# EAGLE design Printrboard (EAGLE 6.6.0)
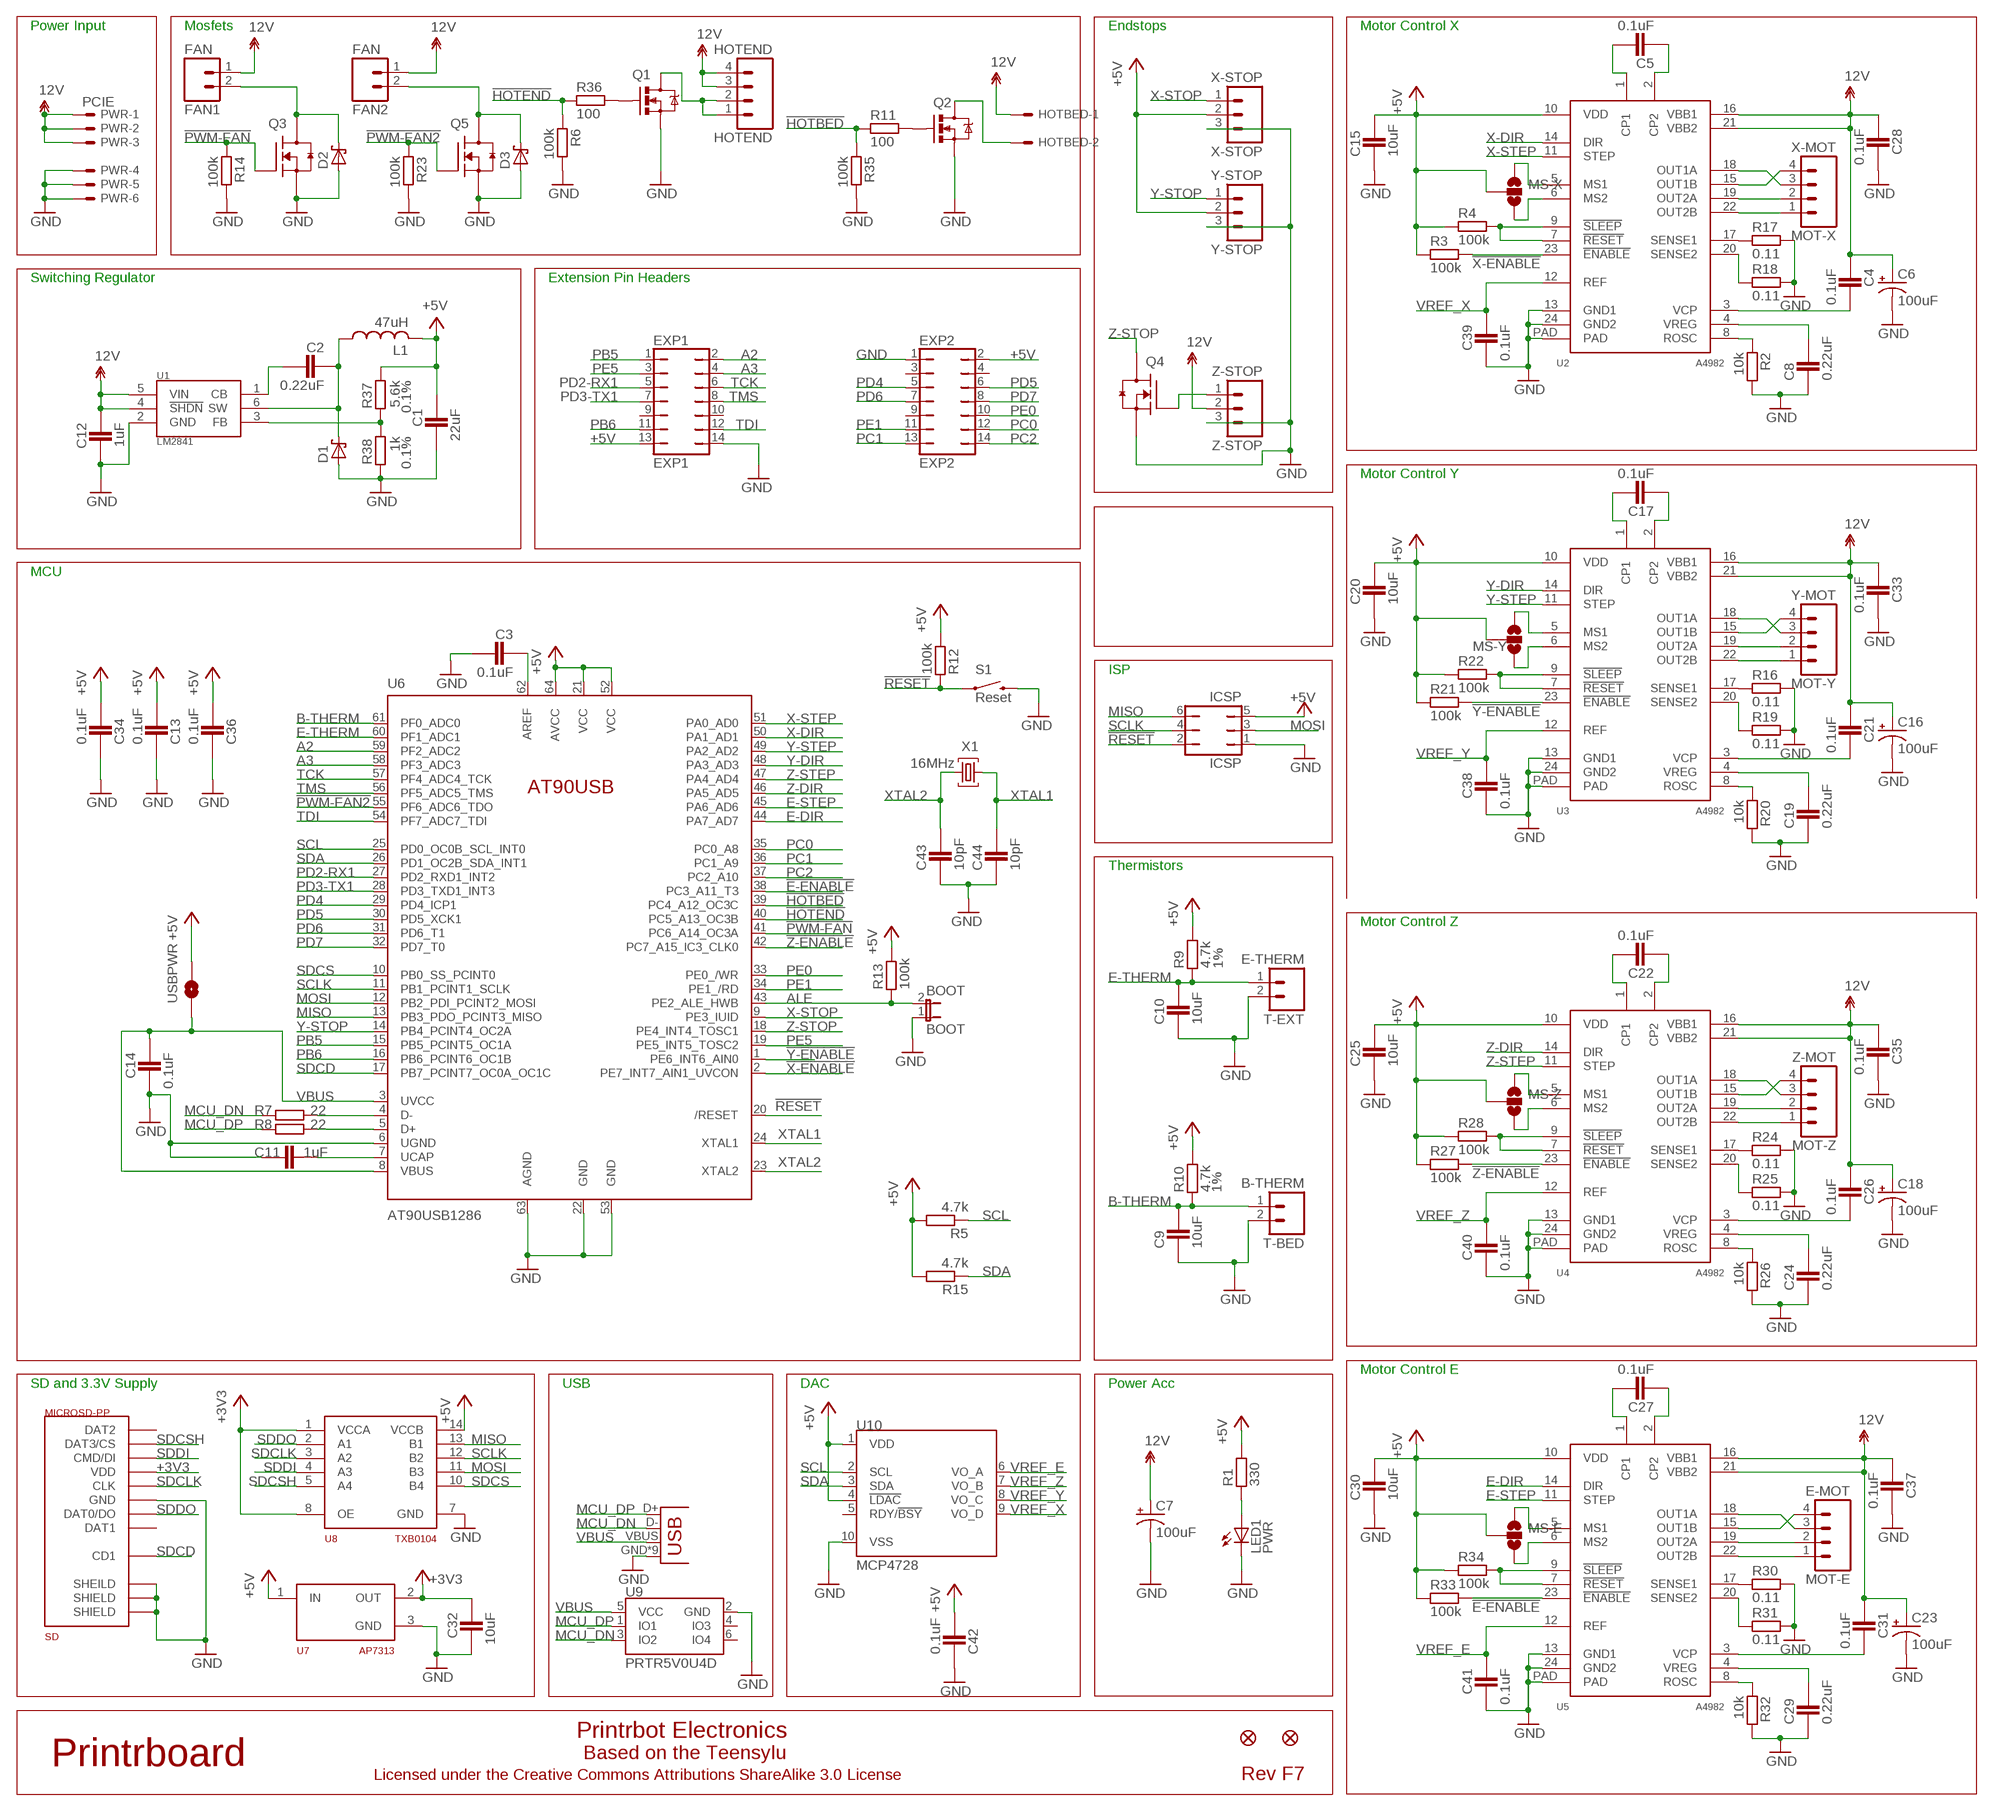
[diagram p0: schematic, sheet 1]

## Parts
BOOT  BOOT  JUMPER-2PTH  [1X02]
C1  22uF  CAPACITOR_0805  [CAPC2012X145AN]
C2  0.22uF  CAPACITOR_0805  [CAPC2012X145AN]
C3  0.1uF  CAPACITOR_0805  [CAPC2012X145AN]
C4  0.1uF  CAPACITOR_0805  [CAPC2012X145AN]
C5  0.1uF  CAPACITOR_0805  [CAPC2012X145AN]
C6  100uF  CPOL-USD  [PANASONIC_D]
C7  100uF  CPOL-USD  [PANASONIC_D]
C8  0.22uF  CAPACITOR_0805  [CAPC2012X145AN]
C9  10uF  CAPACITOR_0805  [CAPC2012X145AN]
C10  10uF  CAPACITOR_0805  [CAPC2012X145AN]
C11  1uF  CAPACITOR_0805  [CAPC2012X145AN]
C12  1uF  CAPACITOR_0805  [CAPC2012X145AN]
C13  0.1uF  CAPACITOR_0805  [CAPC2012X145AN]
C14  0.1uF  CAPACITOR_0805  [CAPC2012X145AN]
C15  10uF  CAPACITOR_0805  [CAPC2012X145AN]
C16  100uF  CPOL-USD  [PANASONIC_D]
C17  0.1uF  CAPACITOR_0805  [CAPC2012X145AN]
C18  100uF  CPOL-USD  [PANASONIC_D]
C19  0.22uF  CAPACITOR_0805  [CAPC2012X145AN]
C20  10uF  CAPACITOR_0805  [CAPC2012X145AN]
C21  0.1uF  CAPACITOR_0805  [CAPC2012X145AN]
C22  0.1uF  CAPACITOR_0805  [CAPC2012X145AN]
C23  100uF  CPOL-USD  [PANASONIC_D]
C24  0.22uF  CAPACITOR_0805  [CAPC2012X145AN]
C25  10uF  CAPACITOR_0805  [CAPC2012X145AN]
C26  0.1uF  CAPACITOR_0805  [CAPC2012X145AN]
C27  0.1uF  CAPACITOR_0805  [CAPC2012X145AN]
C28  0.1uF  CAPACITOR_0805  [CAPC2012X145AN]
C29  0.22uF  CAPACITOR_0805  [CAPC2012X145AN]
C30  10uF  CAPACITOR_0805  [CAPC2012X145AN]
C31  0.1uF  CAPACITOR_0805  [CAPC2012X145AN]
C32  10uF  CAPACITOR_0805  [CAPC2012X145AN]
C33  0.1uF  CAPACITOR_0805  [CAPC2012X145AN]
C34  0.1uF  CAPACITOR_0805  [CAPC2012X145AN]
C35  0.1uF  CAPACITOR_0805  [CAPC2012X145AN]
C36  0.1uF  CAPACITOR_0805  [CAPC2012X145AN]
C37  0.1uF  CAPACITOR_0805  [CAPC2012X145AN]
C38  0.1uF  CAPACITOR_0805  [CAPC2012X145AN]
C39  0.1uF  CAPACITOR_0805  [CAPC2012X145AN]
C40  0.1uF  CAPACITOR_0805  [CAPC2012X145AN]
C41  0.1uF  CAPACITOR_0805  [CAPC2012X145AN]
C42  0.1uF  CAPACITOR_0805  [CAPC2012X145AN]
C43  10pF  CAPACITOR_0805  [CAPC2012X145AN]
C44  10pF  CAPACITOR_0805  [CAPC2012X145AN]
D1  SCH-DIODESMA  [SMA]
D2  SCH-DIODESMA  [SMA]
D3  SCH-DIODESMA  [SMA]
E-MOT  MOT-E  M04POLAR  [MOLEX-1X4]
EXP1  EXP1  JP7Q  [JP7Q]
EXP2  EXP2  JP7Q  [JP7Q]
FAN1  FAN  M02PTH  [1X02]
FAN2  FAN  M02PTH  [1X02]
HOTBED  PHOENIX-2POS-5MM-SCREW  [PHOENIX-5MM-2POS]
HOTEND  HOTEND  M04POLAR  [MOLEX-1X4]
ICSP  ICSP  JP3Q  [JP3Q]
JP26  FIDUCIAL1X2.5  [FIDUCIAL-1X2.5]
JP33  FIDUCIAL1X2.5  [FIDUCIAL-1X2.5]
L1  47uH  L-US  [SDR1006]
LED1  PWR  LEDCHIP-LED0805  [CHIP-LED0805]
MS-E  SOLDERJUMPER_2WAYCONNECTED  [SJ_3_CONNECTED]
MS-X  SOLDERJUMPER_2WAYCONNECTED  [SJ_3_CONNECTED]
MS-Y  SOLDERJUMPER_2WAYCONNECTED  [SJ_3_CONNECTED]
MS-Z  SOLDERJUMPER_2WAYCONNECTED  [SJ_3_CONNECTED]
PWR  PCIE  5566-6  [5566-6]
Q1  RFP30N06LE  MOSFET-NCHANNELPTH2  [TO220V]
Q2  RFP30N06LE  MOSFET-NCHANNELPTH2  [TO220V]
Q3  RFP30N06LE  MOSFET-NCH_SOT-23  [SOT95P280X135-3N]
Q4  RFP30N06LE  MOSFET-NCH_SOT-23  [SOT95P280X135-3N]
Q5  RFP30N06LE  MOSFET-NCH_SOT-23  [SOT95P280X135-3N]
R1  330  RESISTOR_0805  [RESC2012X70N]
R2  10k  RESISTOR_0805  [RESC2012X70N]
R3  100k  RESISTOR_0805  [RESC2012X70N]
R4  100k  RESISTOR_0805  [RESC2012X70N]
R5  4.7k  RESISTOR_0805  [RESC2012X70N]
R6  100k  RESISTOR_0805  [RESC2012X70N]
R7  22  RESISTOR_0805  [RESC2012X70N]
R8  22  RESISTOR_0805  [RESC2012X70N]
R9  4.7k  RESISTOR_0805  [RESC2012X70N]
R10  4.7k  RESISTOR_0805  [RESC2012X70N]
R11  100  RESISTOR_0805  [RESC2012X70N]
R12  100k  RESISTOR_0805  [RESC2012X70N]
R13  100k  RESISTOR_0805  [RESC2012X70N]
R14  100k  RESISTOR_0805  [RESC2012X70N]
R15  4.7k  RESISTOR_0805  [RESC2012X70N]
R16  0.11  RESISTOR_0805  [RESC2012X70N]
R17  0.11  RESISTOR_0805  [RESC2012X70N]
R18  0.11  RESISTOR_0805  [RESC2012X70N]
R19  0.11  RESISTOR_0805  [RESC2012X70N]
R20  10k  RESISTOR_0805  [RESC2012X70N]
R21  100k  RESISTOR_0805  [RESC2012X70N]
R22  100k  RESISTOR_0805  [RESC2012X70N]
R23  100k  RESISTOR_0805  [RESC2012X70N]
R24  0.11  RESISTOR_0805  [RESC2012X70N]
R25  0.11  RESISTOR_0805  [RESC2012X70N]
R26  10k  RESISTOR_0805  [RESC2012X70N]
R27  100k  RESISTOR_0805  [RESC2012X70N]
R28  100k  RESISTOR_0805  [RESC2012X70N]
R30  0.11  RESISTOR_0805  [RESC2012X70N]
R31  0.11  RESISTOR_0805  [RESC2012X70N]
R32  10k  RESISTOR_0805  [RESC2012X70N]
R33  100k  RESISTOR_0805  [RESC2012X70N]
R34  100k  RESISTOR_0805  [RESC2012X70N]
R35  100k  RESISTOR_0805  [RESC2012X70N]
R36  100  RESISTOR_0805  [RESC2012X70N]
R37  5.6k  RESISTOR_0805  [RESC2012X70N]
R38  1k  RESISTOR_0805  [RESC2012X70N]
S1  Reset  SWITCH-MOMENTARY-2  [TACTILE_SWITCH_TALL]
SD  MICROSD-PP  [USD-101-00660-68-6]
T-BED  B-THERM  M02PTH  [1X02]
T-EXT  E-THERM  M02PTH  [1X02]
U1  LM2841  [TSOT6]
U2  A4982  [TSSOP-24]
U3  A4982  [TSSOP-24]
U4  A4982  [TSSOP-24]
U5  A4982  [TSSOP-24]
U6  AT90USB1286  AT90USB  [TQFP64-2]
U7  AP7313  [SOT23C]
U8  TXB0104  [TSSOP14]
U9  PRTR5V0U4D  [SOT23-6]
U10  MCP4728  [MSOP10]
USB-M  USB-MICRO-PTH  [USB-MICROB-PTH]
USBPWR  SOLDERJUMPERNO  [SJ_2S-NO]
X1  16MHz  XTAL  [NDK-XTAL]
X-MOT  MOT-X  M04POLAR  [MOLEX-1X4]
X-STOP  X-STOP  M03POLAR  [MOLEX-1X3]
Y-MOT  MOT-Y  M04POLAR  [MOLEX-1X4]
Y-STOP  Y-STOP  M03POLAR  [MOLEX-1X3]
Z-MOT  MOT-Z  M04POLAR  [MOLEX-1X4]
Z-STOP  Z-STOP  M03POLAR  [MOLEX-1X3]

## Nets
12V: C4.1 C6.+ C7.+ C12.1 C16.+ C18.+ C21.1 C23.+ C26.1 C28.1 C31.1 C33.1 C35.1 C37.1 FAN1.1 FAN2.1 HOTBED.P$1 HOTEND.3 HOTEND.4 PWR.1 PWR.2 PWR.3 U1.4(!SHDN) U1.5(VIN) U2.16(VBB1) U2.21(VBB2) U3.16(VBB1) U3.21(VBB2) U4.16(VBB1) U4.21(VBB2) U5.16(VBB1) U5.21(VBB2) Z-STOP.2
!E-ENABLE: R33.2 U5.23(!ENABLE) U6.38(PC3_A11_T3)
!HOTBED: R11.1 R35.1 U6.39(PC4_A12_OC3C)
!HOTEND: R6.1 R36.1 U6.40(PC5_A13_OC3B)
!PWM-FAN: Q3.1(G) R14.1 U6.41(PC6_A14_OC3A)
!PWM-FAN2: Q5.1(G) R23.1 U6.55(PF6_ADC6_TDO)
!RESET: ICSP.2 R12.1 S1.A2 U6.20(/RESET)
!X-ENABLE: R3.2 U2.23(!ENABLE) U6.2(PE7_INT7_AIN1_UVCON)
!Y-ENABLE: R21.2 U3.23(!ENABLE) U6.1(PE6_INT6_AIN0)
!Z-ENABLE: R27.2 U4.23(!ENABLE) U6.42(PC7_A15_IC3_CLK0)
+3V3 [power]: C32.1 SD.P$4(VDD) U7.2(OUT) U8.1(VCCA) U8.8(OE)
+5V [power]: C1.1 C13.2 C15.2 C20.2 C25.2 C30.2 C34.2 C36.2 C42.2 EXP1.13 EXP2.2 ICSP.5 L1.P$2 MS-E.2 MS-X.2 MS-Y.2 MS-Z.2 R1.2 R3.1 R4.1 R5.2 R9.2 R10.2 R12.2 R13.2 R15.2 R21.1 R22.1 R27.1 R28.1 R33.1 R34.1 R37.1 U2.10(VDD) U3.10(VDD) U4.10(VDD) U5.10(VDD) U6.21(VCC) U6.52(VCC) U6.64(AVCC) U7.1(IN) U8.14(VCCB) U10.1(VDD) U10.4(!LDAC) USBPWR.2 X-STOP.2 Y-STOP.2
A2: EXP1.2 U6.59(PF2_ADC2)
A3: EXP1.4 U6.58(PF3_ADC3)
ALE: BOOT.2 R13.1 U6.43(PE2_ALE_HWB)
AREF: C3.1 U6.62(AREF)
B-THERM: C9.2 R10.1 T-BED.1 U6.61(PF0_ADC0)
E-DIR: U5.14(DIR) U6.44(PA7_AD7)
E-STEP: U5.11(STEP) U6.45(PA6_AD6)
E-THERM: C10.2 R9.1 T-EXT.1 U6.60(PF1_ADC1)
GND [power]: BOOT.1 C1.2 C3.2 C6.- C7.- C8.1 C9.1 C10.1 C11.1 C12.2 C13.1 C14.2 C15.1 C16.- C18.- C19.1 C20.1 C23.- C24.1 C25.1 C28.2 C29.1 C30.1 C32.2 C33.2 C34.1 C35.2 C36.1 C37.2 C38.2 C39.2 C40.2 C41.2 C42.1 C43.1 C44.1 D1.A D2.A D3.A EXP1.14 EXP2.1 ICSP.1 LED1.C PWR.4 PWR.5 PWR.6 Q1.3(S) Q2.3(S) Q3.2(S) Q4.2(S) Q5.2(S) R2.2 R6.2 R14.2 R16.2 R17.2 R18.2 R19.2 R20.2 R23.2 R24.2 R25.2 R26.2 R30.2 R31.2 R32.2 R35.2 R38.2 S1.B2 SD.GND1(SHEILD) SD.GND2(SHIELD) SD.GND3(SHIELD) SD.P$6(GND) T-BED.2 T-EXT.2 U1.2(GND) U2.13(GND1) U2.24(GND2) U2.PAD U3.13(GND1) U3.24(GND2) U3.PAD U4.13(GND1) U4.24(GND2) U4.PAD U5.13(GND1) U5.24(GND2) U5.PAD U6.6(UGND) U6.22(GND) U6.53(GND) U6.63(AGND) U7.3(GND) U8.7(GND) U9.2(GND) U10.10(VSS) USB-M.GND USB-M.GND1(GND) USB-M.GND2(GND) USB-M.GND3(GND) USB-M.GND4(GND) USB-M.GND5(GND) USB-M.GND6(GND) USB-M.GND7(GND) USB-M.GND8(GND) X-STOP.3 Y-STOP.3 Z-STOP.3
HOTBED-GND [power]: HOTBED.P$2 Q2.2(D)
HOTEND-GND [power]: HOTEND.1 HOTEND.2 Q1.2(D)
MCU_DN: R7.1 U9.3(IO2) USB-M.D-
MCU_DP: R8.1 U9.1(IO1) USB-M.D+
MISO: ICSP.6 U6.13(PB3_PDO_PCINT3_MISO) U8.13(B1)
MOSI: ICSP.3 U6.12(PB2_PDI_PCINT2_MOSI) U8.11(B3)
N$1: LED1.A R1.1
N$2: D2.C FAN1.2 Q3.3(D)
N$3: R7.2 U6.4(D-)
N$4: R8.2 U6.5(D+)
N$6: Q4.1(G) Z-STOP.1
N$7: Q2.1(G) R11.2
N$8: D3.C FAN2.2 Q5.3(D)
N$9: C11.2 U6.7(UCAP)
N$10: U2.18(OUT1A) X-MOT.3
N$11: C5.2 U2.1(CP1)
N$12: C5.1 U2.2(CP2)
N$13: R2.1 U2.8(ROSC)
N$14: R17.1 U2.17(SENSE1)
N$15: R18.1 U2.20(SENSE2)
N$16: C4.2 U2.3(VCP)
N$17: U2.15(OUT1B) X-MOT.4
N$19: C8.2 U2.4(VREG)
N$20: U2.19(OUT2A) X-MOT.2
N$21: R4.2 U2.7(!RESET) U2.9(!SLEEP)
N$22: R37.2 R38.1 U1.3(FB)
N$23: U2.22(OUT2B) X-MOT.1
N$24: U3.19(OUT2A) Y-MOT.2
N$25: U3.22(OUT2B) Y-MOT.1
N$26: U3.15(OUT1B) Y-MOT.4
N$27: MS-X.1 U2.5(MS1)
N$28: MS-X.3 U2.6(MS2)
N$29: C17.2 U3.1(CP1)
N$30: C17.1 U3.2(CP2)
N$31: U3.18(OUT1A) Y-MOT.3
N$32: R19.1 U3.20(SENSE2)
N$34: R20.1 U3.8(ROSC)
N$35: C19.2 U3.4(VREG)
N$36: R22.2 U3.7(!RESET) U3.9(!SLEEP)
N$37: C21.2 U3.3(VCP)
N$38: R16.1 U3.17(SENSE1)
N$39: U4.15(OUT1B) Z-MOT.4
N$40: U4.18(OUT1A) Z-MOT.3
N$41: U4.19(OUT2A) Z-MOT.2
N$42: MS-Y.1 U3.5(MS1)
N$43: MS-Y.3 U3.6(MS2)
N$44: C22.2 U4.1(CP1)
N$45: C22.1 U4.2(CP2)
N$46: R24.1 U4.17(SENSE1)
N$47: R25.1 U4.20(SENSE2)
N$49: R26.1 U4.8(ROSC)
N$50: C24.2 U4.4(VREG)
N$51: R28.2 U4.7(!RESET) U4.9(!SLEEP)
N$52: C26.2 U4.3(VCP)
N$53: U4.22(OUT2B) Z-MOT.1
N$54: E-MOT.4 U5.15(OUT1B)
N$55: E-MOT.3 U5.18(OUT1A)
N$56: E-MOT.2 U5.19(OUT2A)
N$57: MS-Z.1 U4.5(MS1)
N$58: MS-Z.3 U4.6(MS2)
N$59: C27.2 U5.1(CP1)
N$60: C27.1 U5.2(CP2)
N$61: R30.1 U5.17(SENSE1)
N$62: R31.1 U5.20(SENSE2)
N$64: R32.1 U5.8(ROSC)
N$65: C29.2 U5.4(VREG)
N$66: R34.2 U5.7(!RESET) U5.9(!SLEEP)
N$67: C31.2 U5.3(VCP)
N$68: E-MOT.1 U5.22(OUT2B)
N$71: Q1.1(G) R36.2
N$72: MS-E.1 U5.5(MS1)
N$73: MS-E.3 U5.6(MS2)
N$75: C2.1 D1.C L1.P$1 U1.6(SW)
N$77: C2.2 U1.1(CB)
PB5: EXP1.1 U6.15(PB5_PCINT5_OC1A)
PB6: EXP1.11 U6.16(PB6_PCINT6_OC1B)
PC0: EXP2.12 U6.35(PC0_A8)
PC1: EXP2.13 U6.36(PC1_A9)
PC2: EXP2.14 U6.37(PC2_A10)
PD2-RX1: EXP1.5 U6.27(PD2_RXD1_INT2)
PD3-TX1: EXP1.7 U6.28(PD3_TXD1_INT3)
PD4: EXP2.5 U6.29(PD4_ICP1)
PD5: EXP2.6 U6.30(PD5_XCK1)
PD6: EXP2.7 U6.31(PD6_T1)
PD7: EXP2.8 U6.32(PD7_T0)
PE0: EXP2.10 U6.33(PE0_/WR)
PE1: EXP2.11 U6.34(PE1_/RD)
PE5: EXP1.3 U6.19(PE5_INT5_TOSC2)
SCL [power]: R5.1 U6.25(PD0_OC0B_SCL_INT0) U10.2(SCL)
SCLK: ICSP.4 U6.11(PB1_PCINT1_SCLK) U8.12(B2)
SDA [power]: R15.1 U6.26(PD1_OC2B_SDA_INT1) U10.3(SDA)
SDCD: SD.CD(CD1) U6.17(PB7_PCINT7_OC0A_OC1C)
SDCLK: SD.P$5(CLK) U8.3(A2)
SDCS: U6.10(PB0_SS_PCINT0) U8.10(B4)
SDCSH: SD.P$2(DAT3/CS) U8.5(A4)
SDDI: SD.P$3(CMD/DI) U8.4(A3)
SDDO: SD.P$7(DAT0/DO) U8.2(A1)
TCK: EXP1.6 U6.57(PF4_ADC4_TCK)
TDI: EXP1.12 U6.54(PF7_ADC7_TDI)
TMS: EXP1.8 U6.56(PF5_ADC5_TMS)
VBUS: C14.1 U6.3(UVCC) U6.8(VBUS) U9.5(VCC) USB-M.VBUS USBPWR.1
VREF_E: C41.1 U5.12(REF) U10.6(VO_A)
VREF_X: C39.1 U2.12(REF) U10.9(VO_D)
VREF_Y: C38.1 U3.12(REF) U10.8(VO_C)
VREF_Z: C40.1 U4.12(REF) U10.7(VO_B)
X-DIR: U2.14(DIR) U6.50(PA1_AD1)
X-STEP: U2.11(STEP) U6.51(PA0_AD0)
X-STOP: U6.9(PE3_IUID) X-STOP.1
XTAL1: C44.2 U6.24(XTAL1) X1.P$1
XTAL2: C43.2 U6.23(XTAL2) X1.P$2
Y-DIR: U3.14(DIR) U6.48(PA3_AD3)
Y-STEP: U3.11(STEP) U6.49(PA2_AD2)
Y-STOP: U6.14(PB4_PCINT4_OC2A) Y-STOP.1
Z-DIR: U4.14(DIR) U6.46(PA5_AD5)
Z-STEP: U4.11(STEP) U6.47(PA4_AD4)
Z-STOP: Q4.3(D) U6.18(PE4_INT4_TOSC1)
Unconnected: EXP1.9 EXP1.10 EXP2.3 EXP2.4 EXP2.9 SD.P$1(DAT2) SD.P$8(DAT1) U9.4(IO3) U9.6(IO4) U10.5(RDY/!BSY)

## Notes on the sheet
- Power Input | Mosfets | Endstops | Motor Control X
- Switching Regulator | Extension Pin Headers
- Motor Control Y
- MCU
- ISP
- Thermistors
- Motor Control Z
- Motor Control E
- SD and 3.3V Supply | USB | DAC | Power Acc
- Printrbot Electronics
- Based on the Teensylu
- Printrboard
- Licensed under the Creative Commons Attributions ShareAlike 3.0 License | Rev F7

## Library data of the parts
BOOT = SparkFun:JUMPER-2: Jumper Basic 0.1" spaced jumper. Use with breakaway headers.
C1-C5 C8-C15 C17 C19-C22 C24-C44 = ipc-7351-capacitor:CAPACITOR_
C6 C7 C16 C18 C23 = rcl:CPOL-US: POLARIZED CAPACITOR, American symbol
D1-D3 = printrbot:SCH-DIODE: Schottky Diodes Source: Fairchild .. BAT54.pdf
E-MOT HOTEND X-MOT Y-MOT Z-MOT = SparkFun:M04: Header 4 Standard 4-pin 0.1" header. Use with straight break away headers (SKU : PRT-00116), right angle break away headers (PRT-00553), swiss pins (PRT-00743), machine pins (PRT-00117), and female headers (PRT-00115). Molex polarized connector foot print use with SKU : PRT-08231 with associated crimp pins and housings. 1MM SMD Version SKU: PRT-10208
EXP1 EXP2 = printrbot:JP7Q: JUMPER
FAN1 FAN2 T-BED T-EXT = SparkFun:M02: Header 2 Standard 2-pin 0.1" header. Use with straight break away headers (SKU : PRT-00116), right angle break away headers (PRT-00553), swiss pins (PRT-00743), machine pins (PRT-00117), and female headers (PRT-00115). Molex polarized connector foot print use with SKU : PRT-08233 with associated crimp pins and housings.
HOTBED = printrbot:PHOENIX-2POS-5MM-SCREW
ICSP = printrbot:JP3Q: JUMPER
JP26 JP33 = SparkFun:FIDUCIAL: Fiducial Alignment Points Various fiducial points for machine vision alignment.
L1 = printrbot:L-US
LED1 = led:LED: LED OSRAM: - CHIPLED LG R971, LG N971, LY N971, LG Q971, LY Q971, LO R971, LY R971 LH N974, LH R974 LS Q976, LO Q976, LY Q976 LO Q996 - Hyper CHIPLED LW Q18S LB Q993, LB Q99A, LB R99A - SideLED LS A670, LO A670, LY A670, LG A670, LP A670 LB A673, LV A673, LT A673, LW A673 LH A674 LY A675 LS A676, LA A676, LO A676, LY A676, LW A676 LS A679, LY A679, LG A679 - Hyper Micro SIDELED® LS Y876, LA Y876, LO Y876, LY Y876 LT Y87S - SmartLED LW L88C, LW L88S LB L89C, LB L89S, LG L890 LS L89K, LO L89K, LY L89K LS L896, LA L896, LO L896, LY L896 - TOPLED LS T670, LO T670, LY T670, LG T670, LP T670 LSG T670, LSP T670, LSY T670, LOP T670, LYG T670 LG T671, LOG T671, LSG T671 LB T673, LV T673, LT T673, LW T673 LH T674 LS T676, LA T676, LO T676, LY T676, LB T676, LH T676, LSB T676, LW T676 LB T67C, LV T67C, LT T67C, LS T67K, LO T67K, LY T67K, LW E67C LS E67B, LA E67B, LO E67B, LY E67B, LB E67C, LV E67C, LT E67C LW T67C LS T679, LY T679, LG T679 LS T770, LO T770, LY T770, LG T770, LP T770 LB T773, LV T773, LT T773, LW T773 LH T774 LS E675, LA E675, LY E675, LS T675 LS T776, LA T776, LO T776, LY T776, LB T776 LHGB T686 LT T68C, LB T68C - Hyper Mini TOPLED® LB M676 - Mini TOPLED Santana® LG M470 LS M47K, LO M47K, LY M47K Source: http://www.osram.convergy.de LUXEON: - LUMILED® LXK2-PW12-R00, LXK2-PW12-S00, LXK2-PW14-U00, LXK2-PW14-V00 LXK2-PM12-R00, LXK2-PM12-S00, LXK2-PM14-U00 LXK2-PE12-Q00, LXK2-PE12-R00, LXK2-PE12-S00, LXK2-PE14-T00, LXK2-PE14-U00 LXK2-PB12-K00, LXK2-PB12-L00, LXK2-PB12-M00, LXK2-PB14-N00, LXK2-PB14-P00, LXK2-PB14-Q00 LXK2-PR12-L00, LXK2-PR12-M00, LXK2-PR14-Q00, LXK2-PR14-R00 LXK2-PD12-Q00, LXK2-PD12-R00, LXK2-PD12-S00 LXK2-PH12-R00, LXK2-PH12-S00 LXK2-PL12-P00, LXK2-PL12-Q00, LXK2-PL12-R00 Source: www.luxeon.com KINGBRIGHT: KA-3528ASYC Source: www.kingbright.com
MS-E MS-X MS-Y MS-Z = printrbot:SOLDERJUMPER_2WAY: Solder Jumper 2 way solder jumper
PWR = printrbot:5566-6: Mini FIT connector 6 pol Source: http://www.molex.com; MPN: 95566-61002; OC_FARNELL: unknown; OC_NEWARK: 22K8620
Q1 Q2 = SparkFun:MOSFET-NCHANNEL
Q3-Q5 = ipc-7351-transistor:MOSFET-NCH_
R1-R8 R11-R28 R30-R36 = ipc-7351-resistor:RESISTOR_
R9 R10 = ipc-7351-resistor:RESISTOR_; TOLERANCE: 1%
R37 R38 = ipc-7351-resistor:RESISTOR_; TOLERANCE: 0.1%
S1 = printrbot:SWITCH-MOMENTARY-2
SD = printrbot:MICROSD-PP
U1 = printrbot:LM2841
U2-U5 = printrbot:A4982
U6 = Atmel-at90usb-teensy:AT90USB
U7 = printrbot:AP7313
U8 = printrbot:TXB0104
U9 = printrbot:PRTR5V0U4D
U10 = printrbot:MCP4728
USB-M = printrbot:USB: USB Connectors USB-B-PTH is fully proven SKU : PRT-00139 USB-miniB is fully proven SKU : PRT-00587 USB-A-PCB is untested. USB-A-H is throughly reviewed, but untested. Spark Fun Electronics SKU : PRT-00437 USB-B-SMT is throughly reviewed, but untested. Needs silkscreen touching up. USB-A-S has not been used/tested USB-MB-H has not been used/tested
USBPWR = SparkFun:SOLDERJUMPER: Solder Jumper Standard SMD solder jumper. Used to automate production. Two varients : Normally Open and Normally Closed are the same, but have different paste layers. NC will have a large amount of paste and should jumper during reflow.
X1 = printrbot:XTAL
X-STOP Y-STOP Z-STOP = SparkFun:M03: Header 3 Standard 3-pin 0.1" header. Use with straight break away headers (SKU : PRT-00116), right angle break away headers (PRT-00553), swiss pins (PRT-00743), machine pins (PRT-00117), and female headers (PRT-00115). Molex polarized connector foot print use with SKU : PRT-08232 with associated crimp pins and housings.

## Board
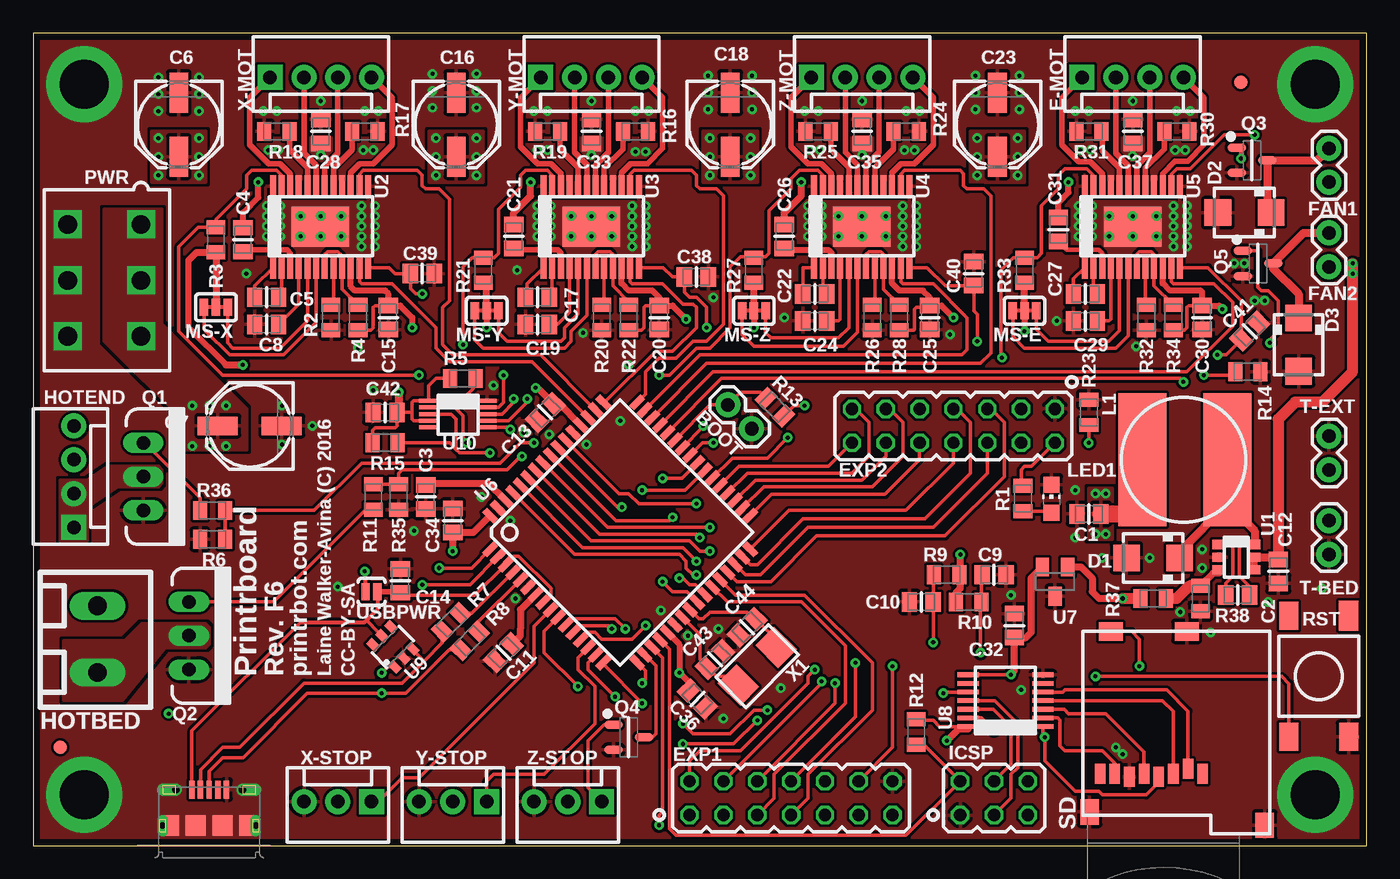
[diagram p1: board, top side]
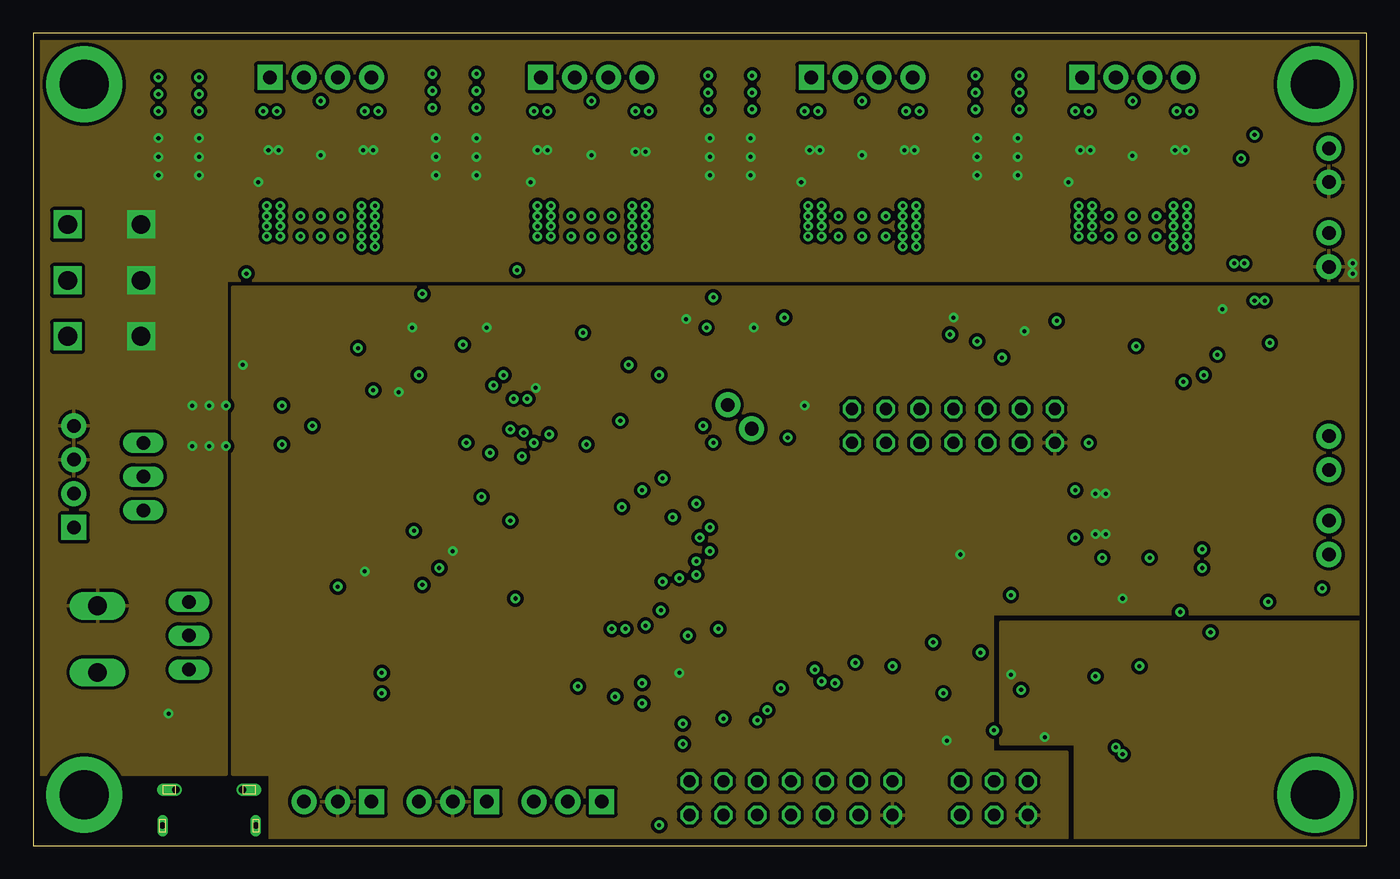
[diagram p2: board, inner layer PWR]
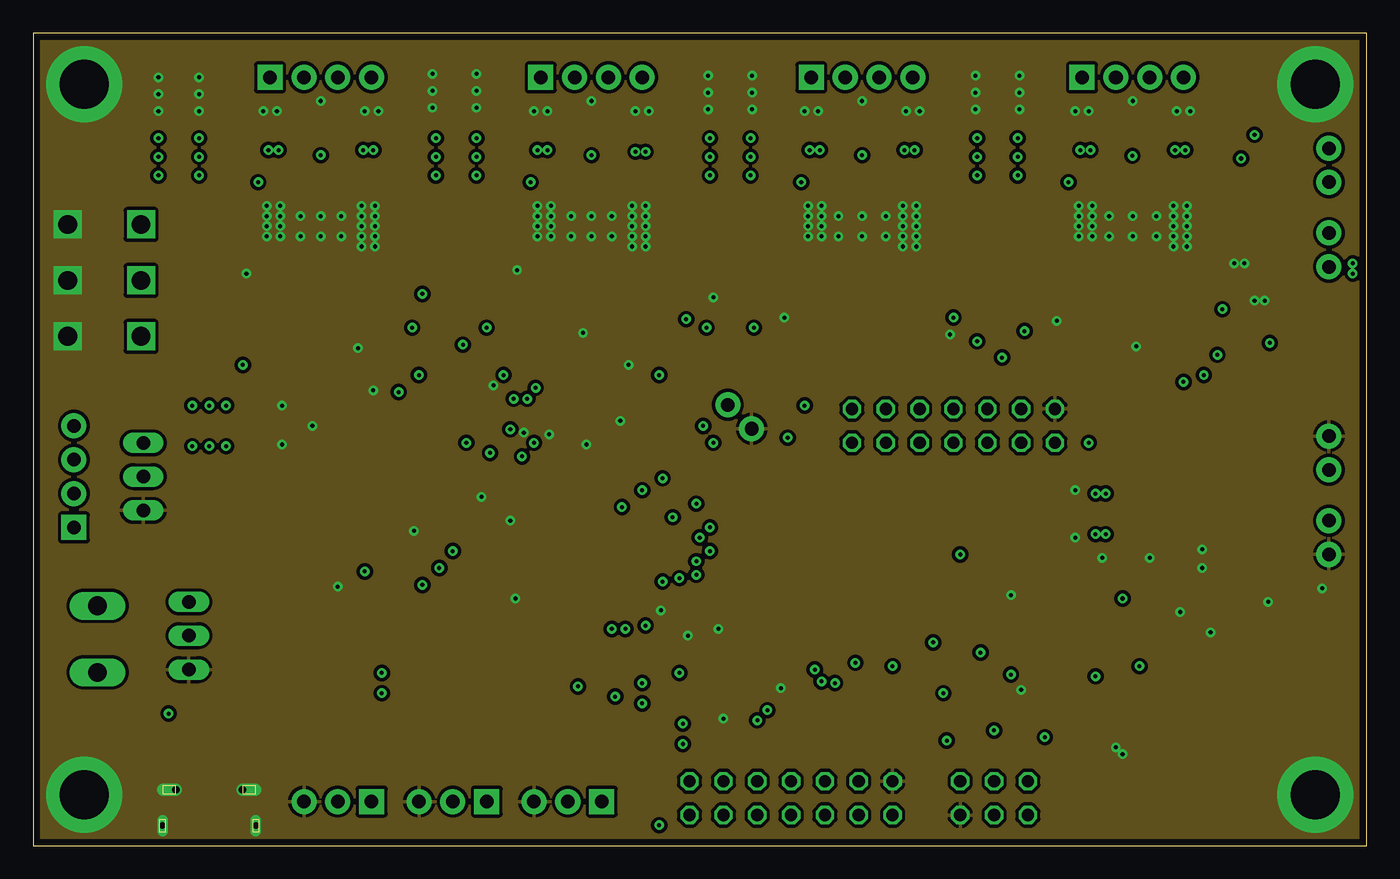
[diagram p3: board, inner layer GND]
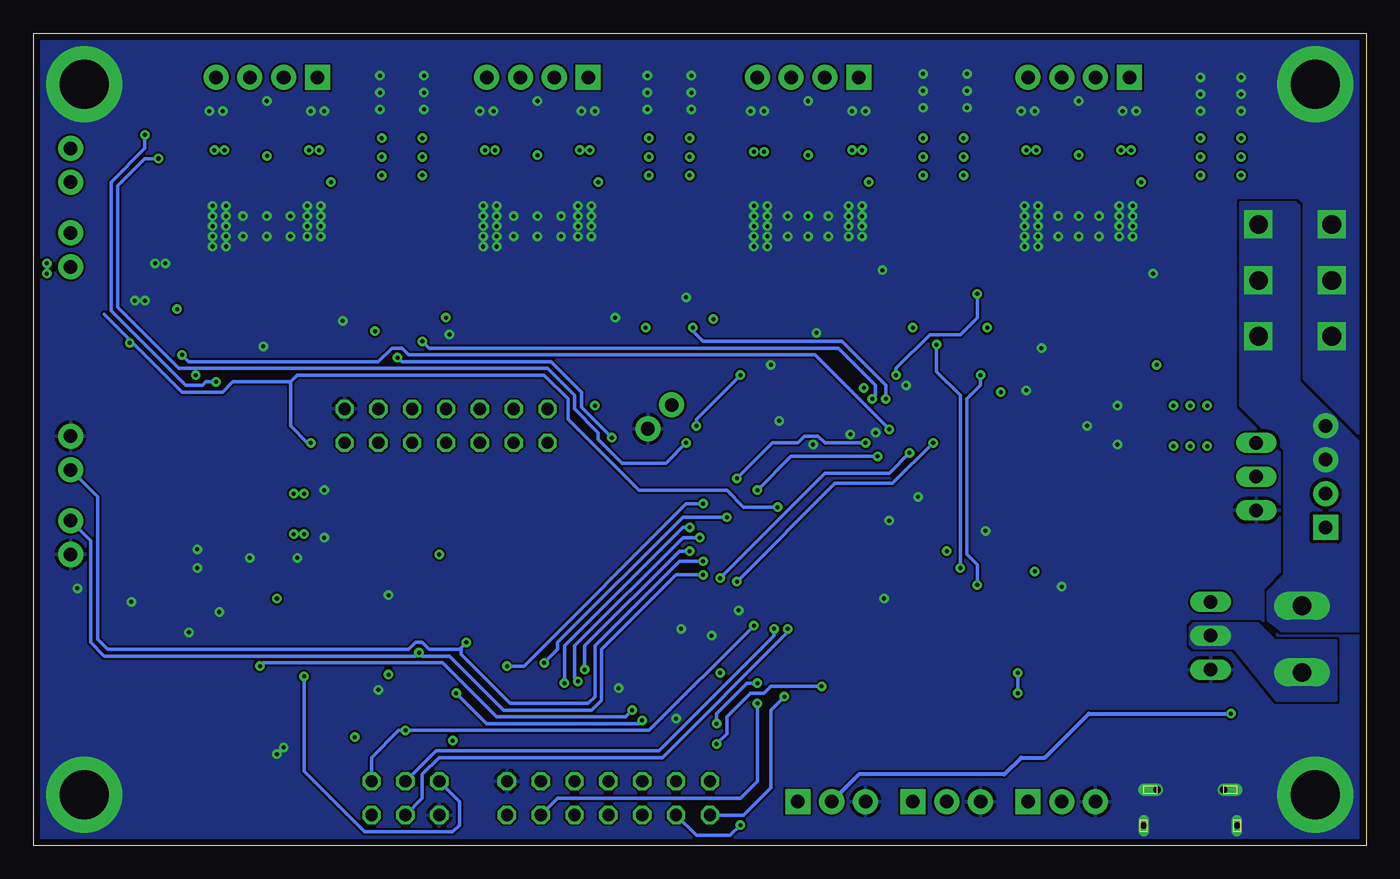
[diagram p4: board, bottom side, seen from below]

Size 100.08 x 60.96 mm. Coordinates in mm from the lower left corner, seen from the top.
Outline: 0,60.96 0,0 100.08,0 100.08,60.96 0,60.96
Copper layers (1*2+3*16): Top 0.035mm / dielectric 0.6mm / PWR 0.035mm / dielectric 0.2mm / GND 0.035mm / dielectric 0.6mm / Bottom 0.035mm
Design rules "4pcb": minimum track width 6mil, minimum drill 12mil, track to track 6mil, track to pad 7mil, pad to pad 6mil, via to via 6mil, smd to smd 0mil, copper to edge 20mil, drill to drill 10mil, minimum pad ring 6mil, minimum via ring 8mil, stop-mask expansion 2mil, vias tented up to drill 100mil, thermal gap 10mil

### Footprints (pad centres in the part's own frame; a part is rotated, then mirrored left to right if it is on the bottom)
1X02 = drill 1.016 pad 1.88: 1 0,0; 2 2.54,0
CAPC2012X145AN = smd 1.15 x 1.45: 1 -0.9,0; 2 0.9,0
PANASONIC_D = smd 3 x 1.4: + 2.4,0; - -2.4,0
SMA = smd 2 x 2: A 2,0; C -2,0
MOLEX-1X4 = drill 1.016 pad 1.88 square: 1 0,0 | drill 1.016 pad 1.88: 2 2.54,0; 3 5.08,0; 4 7.62,0
JP7Q = drill 0.914 octagon: 1 -7.62,-1.27; 2 -7.62,1.27; 3 -5.08,-1.27; 4 -5.08,1.27; 5 -2.54,-1.27; 6 -2.54,1.27; 7 0,-1.27; 8 0,1.27; 9 2.54,-1.27; 10 2.54,1.27; 11 5.08,-1.27; 12 5.08,1.27; 13 7.62,-1.27; 14 7.62,1.27
PHOENIX-5MM-2POS = drill 1.4 long: P$1 -2.5,0; P$2 2.5,0
JP3Q = drill 0.914 octagon: 1 -2.54,-1.27; 2 -2.54,1.27; 3 0,-1.27; 4 0,1.27; 5 2.54,-1.27; 6 2.54,1.27
FIDUCIAL-1X2.5 = smd 1 x 1: 1 0,0
SDR1006 = smd 10.008 x 3.607: P$1 0,3.048; P$2 0,-3.353
CHIP-LED0805 = smd 1.2 x 1.2: A 0,-1.05; C 0,1.05
SJ_3_CONNECTED = smd 0.635 x 1.27: 1 -0.889,0; 2 0,0; 3 0.889,0
5566-6 = drill 1.4 square: 1 4.2,-2.75; 2 0,-2.75; 3 -4.2,-2.75; 4 4.2,2.75; 5 0,2.75; 6 -4.2,2.75
TO220V = drill 1.016 long: 1 -2.54,0; 2 0,0; 3 2.54,0
SOT95P280X135-3N = smd 1.4 x 0.65: 1 -1.15,0.95; 2 -1.15,-0.95; 3 1.15,0
RESC2012X70N = smd 1.05 x 1.4: 1 -0.95,0; 2 0.95,0
TACTILE_SWITCH_TALL = smd 2.1 x 1.45: A1 -4.55,-2.25; A2 4.55,-2.25; B2 4.55,2.25 | smd 2.25 x 1.45: B1 -4.55,2.225
USD-101-00660-68-6 = smd 1.8 x 1.4: CD 11.95,0; GND3 6.25,0 | smd 1.4 x 1.9: GND1 0.4,14.55; GND2 13.55,13.55 | smd 0.8 x 1.5: P$1 5.06,10.7; P$2 6.16,10.3; P$3 7.26,10.7; P$4 8.36,10.9; P$5 9.46,10.7; P$6 10.56,10.9; P$7 11.66,10.7; P$8 12.76,10.7
TSOT6 = smd 0.69 x 1: 1 -1,-1.4; 2 -0.05,-1.4; 3 0.9,-1.4; 4 0.9,1.2; 5 -0.05,1.2; 6 -1,1.2
TSSOP-24 = smd 0.45 x 1.65: 1 -3.6,-3.1; 2 -2.95,-3.1; 3 -2.3,-3.1; 4 -1.65,-3.1; 5 -1,-3.1; 6 -0.35,-3.1; 7 0.3,-3.1; 8 0.95,-3.1; 9 1.6,-3.1; 10 2.25,-3.1; 11 2.9,-3.1; 12 3.55,-3.1; 13 3.55,3; 14 2.9,3; 15 2.25,3; 16 1.6,3; 17 0.95,3; 18 0.3,3; 19 -0.35,3; 20 -1,3; 21 -1.65,3; 22 -2.3,3; 23 -2.95,3; 24 -3.6,3 | smd 4.32 x 3: PAD -0.025,-0.05
TQFP64-2 = smd 1.194 x 0.508: 1 -7.8,6; 2 -7.8,5.2; 3 -7.8,4.4; 4 -7.8,3.6; 5 -7.8,2.8; 6 -7.8,2; 7 -7.8,1.2; 8 -7.8,0.4; 9 -7.8,-0.4; 10 -7.8,-1.2; 11 -7.8,-2; 12 -7.8,-2.8; 13 -7.8,-3.6; 14 -7.8,-4.4; 15 -7.8,-5.2; 16 -7.8,-6; 33 7.8,-6; 34 7.8,-5.2; 35 7.8,-4.4; 36 7.8,-3.6; 37 7.8,-2.8; 38 7.8,-2; 39 7.8,-1.2; 40 7.8,-0.4; 41 7.8,0.4; 42 7.8,1.2; 43 7.8,2; 44 7.8,2.8; 45 7.8,3.6; 46 7.8,4.4; 47 7.8,5.2; 48 7.8,6 | smd 0.508 x 1.194: 17 -6,-7.8; 18 -5.2,-7.8; 19 -4.4,-7.8; 20 -3.6,-7.8; 21 -2.8,-7.8; 22 -2,-7.8; 23 -1.2,-7.8; 24 -0.4,-7.8; 25 0.4,-7.8; 26 1.2,-7.8; 27 2,-7.8; 28 2.8,-7.8; 29 3.6,-7.8; 30 4.4,-7.8; 31 5.2,-7.8; 32 6,-7.8; 49 6,7.8; 50 5.2,7.8; 51 4.4,7.8; 52 3.6,7.8; 53 2.8,7.8; 54 2,7.8; 55 1.2,7.8; 56 0.4,7.8; 57 -0.4,7.8; 58 -1.2,7.8; 59 -2,7.8; 60 -2.8,7.8; 61 -3.6,7.8; 62 -4.4,7.8; 63 -5.2,7.8; 64 -6,7.8
SOT23C = smd 1 x 1.4: 1 -0.95,-1.1; 2 0.95,-1.1; 3 0,1.1
TSSOP14 = smd 0.35 x 1.6: 1 -2,-2.9; 2 -1.35,-2.9; 3 -0.7,-2.9; 4 -0.05,-2.9; 5 0.6,-2.9; 6 1.25,-2.9; 7 1.9,-2.9; 8 1.9,2.7; 9 1.25,2.7; 10 0.6,2.7; 11 -0.05,2.7; 12 -0.7,2.7; 13 -1.35,2.7; 14 -2,2.7
SOT23-6 = smd 0.6 x 0.9: 1 -0.95,-1.15; 2 0,-1.15; 3 0.95,-1.15; 4 0.95,1.15; 5 0,1.15; 6 -0.95,1.15
MSOP10 = smd 0.3 x 1.4: 1 -1,-2.2; 2 -0.5,-2.2; 3 0,-2.2; 4 0.5,-2.2; 5 1,-2.2; 6 1,2.2; 7 0.5,2.2; 8 0,2.2; 9 -0.5,2.2; 10 -1,2.2
USB-MICROB-PTH = smd 0.4 x 1.35: D+ 0,1.905; D- -0.65,1.905; GND 1.3,1.905; ID 0.65,1.905; VBUS -1.3,1.905 | drill 0.5 pad 0.78 long: GND1 -3.5,-0.795; GND6 3.5,-0.795 | smd 1.225 x 1.55: GND2 -2.86,-0.795 | smd 1.5 x 1.55: GND3 -1,-0.795; GND4 1,-0.795 | smd 1.2 x 1.55: GND5 2.86,-0.795 | drill 0.55 pad 0.95 offset: GND7 2.5,1.905; GND8 -2.5,1.905
SJ_2S-NO = smd 0.635 x 1.27: 1 -0.45,0; 2 0.45,0
NDK-XTAL = smd 2 x 2.4: P$1 -2,0; P$2 2,0
MOLEX-1X3 = drill 1.016 pad 1.88 square: 1 0,0 | drill 1.016 pad 1.88: 2 2.54,0; 3 5.08,0

### Placement (x,y rotation side)
BOOT  53.94,31.28 135 top
C1  79.25,24.89 180 top
C2  90.42,18.8 180 top
C3  29.46,26.16 270 top
C4  15.75,45.47 270 top
C5  17.53,41.15 180 top
C6  10.92,54.1 270 top
C7  16.26,31.5 180 top
C8  17.53,39.12 0 top
C9  72.14,20.32 180 top
C10  66.67,18.29 0 top
C11  35.31,14.48 45 top
C12  93.47,20.57 270 top
C13  38.43,32.51 45 top
C14  27.56,19.87 90 top
C15  26.67,39.62 90 top
C16  31.75,54.1 270 top
C17  37.85,41.15 180 top
C18  52.32,54.1 270 top
C19  37.85,39.12 0 top
C20  46.99,39.62 90 top
C21  36.07,45.72 270 top
C22  58.67,41.4 180 top
C23  72.39,54.1 270 top
C24  58.67,39.37 0 top
C25  67.31,39.62 90 top
C26  56.39,45.72 270 top
C27  78.99,41.4 180 top
C28  21.59,53.59 90 top
C29  78.99,39.37 0 top
C30  87.76,39.62 90 top
C31  76.96,46.23 270 top
C32  73.66,16.51 90 top
C33  41.91,53.59 90 top
C34  31.5,24.38 270 top
C35  62.23,53.59 90 top
C36  49.86,11 135 top
C37  82.55,53.59 90 top
C38  49.78,42.67 0 top
C39  29.21,42.93 0 top
C40  70.61,42.93 90 top
C41  91.33,38.61 45 top
C42  26.42,32.51 0 top
C43  51.18,13.97 225 top
C44  53.59,16.38 45 top
D1  84.07,21.59 180 top
D2  90.93,47.5 180 top
D3  95,37.59 270 top
E-MOT  78.74,57.66 0 top
EXP1  56.9,3.56 0 top
EXP2  69.09,31.5 180 top
FAN1  97.28,49.78 90 top
FAN2  97.28,43.43 90 top
HOTBED  4.83,15.49 270 top
HOTEND  3.05,23.88 90 top
ICSP  72.14,3.56 0 top
JP26  2.03,7.37 0 top
JP33  90.68,57.28 0 top
L1  86.61,28.96 270 top
LED1  76.45,26.04 0 top
MS-E  74.42,40.13 180 top
MS-X  13.72,40.39 180 top
MS-Y  34.04,40.13 180 top
MS-Z  54.1,40.13 180 top
PWR  5.33,42.42 90 top
Q1  8.26,27.69 270 top
Q2  11.68,15.75 270 top
Q3  91.5,51.44 0 top
Q4  44.7,8.13 0 top
Q5  91.95,43.69 0 top
R1  74.3,26.04 90 top
R2  22.35,39.62 270 top
R3  13.72,45.47 90 top
R4  24.38,39.62 90 top
R5  32.26,35.05 180 top
R6  13.46,22.99 180 top
R7  31.37,16.76 45 top
R8  32.77,15.37 45 top
R9  68.58,20.32 0 top
R10  70.23,18.29 180 top
R11  25.53,26.16 270 top
R12  66.29,8.51 90 top
R13  55.67,32.91 315 top
R14  91.19,35.56 0 top
R15  26.42,30.23 180 top
R16  45.21,53.59 0 top
R17  24.89,53.59 0 top
R18  18.29,53.59 180 top
R19  38.61,53.59 180 top
R20  42.67,39.62 270 top
R21  33.78,43.18 90 top
R22  44.7,39.62 90 top
R23  79.25,32.51 90 top
R24  65.53,53.59 0 top
R25  58.93,53.59 180 top
R26  62.99,39.62 270 top
R27  54.1,43.18 90 top
R28  65.02,39.62 90 top
R30  85.85,53.59 0 top
R31  79.25,53.59 180 top
R32  83.57,39.62 270 top
R33  74.42,43.18 90 top
R34  85.6,39.62 90 top
R35  27.43,26.16 270 top
R36  13.46,25.15 180 top
R37  84.07,18.54 0 top
R38  87.63,18.54 270 top
S1  96.52,12.7 270 top
SD  92.86,16.07 180 top
T-BED  97.28,24.38 270 top
T-EXT  97.28,28.19 90 top
U1  90.42,21.59 270 top
U2  21.59,46.48 0 top
U3  41.91,46.48 0 top
U4  62.23,46.48 0 top
U5  82.55,46.48 0 top
U6  44.07,23.5 45 top
U7  76.71,19.81 180 top
U8  72.9,10.92 90 top
U9  27,14.91 45 top
U10  31.88,32.38 270 top
USB-M  13.21,2.29 0 top
USBPWR  25.4,19.05 180 top
X1  54.36,13.46 225 top
X-MOT  17.78,57.66 0 top
X-STOP  25.4,3.3 180 top
Y-MOT  38.1,57.66 0 top
Y-STOP  34.04,3.3 180 top
Z-MOT  58.42,57.66 0 top
Z-STOP  42.67,3.3 180 top

### Tracks (layer width: path | path; a pad name or v marks a point on that pad's centre or on a via)
12V  (via drill 0.3)
  Top 0.254: 93.47,21.34 C12.1
  Top 0.457: C4.1 15.75,47.5 16.89,48.64 v16.89,49.78 | C31.1 76.96,48.26 77.72,49.02 v77.72,49.78
  Top 0.508: C31.1 76.57,47.13 | 36.44,46.62 C21.1 36.07,47.5 37.34,48.77 v37.34,49.78 | v57.66,49.78 57.66,48.77 56.39,47.5 C26.1
  Top 0.61: U1.4 U1.5 93.3,21.64 C12.1
  Top 0.813: v99.06,43.69 99.06,35.56 96.77,33.27 94.74,33.27 93.47,32 C12.1 93.47,21.59
  Bottom 0.305: Z-STOP.2 38.1,5.33 27.18,5.33 25.91,6.6 24.13,6.6 20.83,9.91 v10.16,9.91
  other vias: 17.65,52.2 25.53,52.2 37.85,52.2 45.97,52.07 66.17,52.2 82.52,51.77 86.49,52.2 62.23,51.82 41.91,51.82 21.59,51.82 58.29,52.2 78.61,52.2 73.91,53.09 73.91,51.69 73.91,50.29 70.87,53.09 70.87,51.69 70.87,50.29 12.45,53.09 12.45,51.69 12.45,50.29 9.4,53.09 9.4,51.69 9.4,50.29 53.85,53.09 53.85,51.69 53.85,50.29 50.8,53.09 50.8,51.69 50.8,50.29 33.27,53.09 33.27,51.69 33.27,50.29 30.23,53.09 30.23,51.69 30.23,50.29 45.21,52.07 38.61,52.2 18.41,52.2 24.77,52.2 59.05,52.2 65.41,52.2 79.38,52.2 85.72,52.2 99.06,42.93 14.48,33.02 13.21,33.02 11.94,33.02 13.21,29.97 14.48,29.97 11.94,29.97
  pour Bottom (isolate 0.254, no thermals): 6.1,29.72 9.4,33.02 9.4,48.26 5.33,48.26 5.08,48.01 5.08,34.8 0,29.72 0,16.13 6.35,16.13 7.37,16.89 7.37,19.05 6.1,20.32
  pour PWR (isolate 0.254, rank 6): 100.08,42.42 14.48,42.42 14.48,5.33 0,5.33 0,60.96 100.08,60.96
  pour Top (no thermals): 78.74,50.04 86.61,50.04 86.61,51.31 87.88,52.58 87.88,53.09 77.47,53.09 77.47,52.32 78.74,51.05
  pour Top (isolate 0.254): 70.61,53.59 74.42,53.59 74.42,49.78 70.36,49.78 70.36,53.59
  pour Top (no thermals): 58.29,50.04 66.17,50.04 66.17,51.31 67.44,52.58 67.44,53.09 57.02,53.09 57.02,52.32 58.29,51.05
  pour Top (no thermals): 37.97,50.04 45.85,50.04 45.85,51.31 47.12,52.58 47.12,53.09 36.7,53.09 36.7,52.32 37.97,51.05
  pour Top (no thermals): 17.65,50.04 25.53,50.04 25.53,51.31 26.8,52.58 26.8,53.09 16.38,53.09 16.38,52.32 17.65,51.05
  pour Top: 9.14,53.59 12.95,53.59 12.95,49.78 8.89,49.78 8.89,53.59
  pour Top (isolate 0.254): 50.55,53.59 54.36,53.59 54.36,49.78 50.29,49.78 50.29,53.59
  pour Top (isolate 0.254): 29.97,53.59 33.78,53.59 33.78,49.78 29.72,49.78 29.72,53.59
  pour Top (isolate 0.254, rank 5): 16,29.72 16,32.77 9.4,39.37 9.4,47.75 5.33,47.75 5.33,37.85 11.43,31.75 11.43,29.72
  pour PWR (isolate 0.254, no thermals): 9.65,48.01 6.6,48.01 6.6,36.58 9.65,36.58
  pour Top (isolate 0.254, no thermals): 6.6,47.75 9.65,47.75 9.65,36.83 6.6,36.83
!E-ENABLE  (via drill 0.3)
  Top 0.254: v56.64,30.61 55.12,29.08 52.48,29.08 | U5.23 79.6,50.32 79.12,50.8 77.47,50.8 76.96,50.29 76.96,49.28 75.69,48.01 75.69,44.45 75.37,44.13 R33.2 73.59,44.13 72.64,43.18 72.64,36.53 v72.74,36.62 | U6.38 52.48,29.08 | 52.48,29.08
  Bottom 0.254: v56.64,30.61 58.93,32.89 58.93,34.04 61.21,36.32 72.39,36.32 72.69,36.62 v72.74,36.62
!HOTBED  (via drill 0.3)
  Top 0.254: v45.72,26.67 48.94,26.67 U6.39 | R11.1 R35.1 27.43,27.94 27.69,28.19 35.56,28.19 36.57,29.2 v36.69,29.2
  Bottom 0.254: v36.69,29.2 43.19,29.2 v45.72,26.67
!HOTEND  (via drill 0.3)
  Top 0.254: v47.24,27.56 48.7,27.56 | U6.40 48.7,27.56 | 48.7,27.56 | v37.59,30.23 36.58,30.23 35.05,28.7 24.64,28.7 21.08,25.15 R36.1 R6.1
  Bottom 0.254: v47.24,27.56 44.58,30.23 42.67,30.23 42.16,30.73 41.15,30.73 40.64,30.23 v37.59,30.23
!PWM-FAN  (via drill 0.3)
  Top 0.254: U6.41 | U6.41 50.23,30.23 v51.05,30.23 | R14.1 89.98,35.31 v87.88,35.31 | v90.68,51.56 90.68,52.06 Q3.1
  Bottom 0.254: 87.88,35.81 61.47,35.81 59.44,33.78 59.44,32.77 57.66,30.99 57.66,30.48 55.88,28.7 52.58,28.7 v51.05,30.23 | 87.88,35.81 89.15,35.81 93.73,40.39 93.73,49.53 91.69,51.56 v90.68,51.56 | v87.88,35.31 87.88,35.81
!PWM-FAN2  (via drill 0.3)
  Top 0.254: U6.55 43.86,25.4 v44.2,25.4 | v79.25,30.23 R23.1 | v92.84,37.72 92.84,37.97 93.47,38.61 93.47,40.89 92.71,41.66 92.2,41.66 91.95,41.91 91.95,44.64 Q5.1
  Bottom 0.254: v44.2,25.4 46.74,25.4 48.01,26.67 54.61,26.67 59.94,32 59.94,33.53 61.72,35.31 80.26,35.31 80.77,34.8 | 80.77,34.8 80.77,31.5 79.5,30.23 v79.25,30.23 | 80.77,34.8 85.09,34.8 85.85,34.04 88.9,34.04 92.71,37.85 | 94.74,39.88 92.71,37.85 | v92.84,37.72 92.71,37.85
!RESET  (via drill 0.3)
  Top 0.254: U6.20 | U6.20 47.75,14.72 47.75,1.27 48.26,0.76 65.53,0.76 ICSP.2 66.86,7.56 R12.1 | S1.A2 94.27,12.16 93.73,12.7 v79.76,12.7
  Bottom 0.254: v79.76,12.7 79.76,5.59 75.18,1.02 68.58,1.02 68.07,1.52 68.07,3.3 ICSP.2
!X-ENABLE  (via drill 0.3)
  Top 0.254: U2.23 18.64,50.32 18.29,50.67 16.38,50.67 16,50.29 16,49.28 13.72,46.99 R3.2 12.38,46.42 10.92,44.96 10.92,38.61 14.22,35.31 v28.96,35.31 | v29.21,19.56 32.78,19.56 | U6.2 32.78,19.56 | 32.78,19.56
  Bottom 0.254: v29.21,19.56 29.21,21.08 29.97,21.84 29.97,33.53 28.96,34.54 v28.96,35.31
!Y-ENABLE  (via drill 0.3)
  Top 0.254: U3.23 38.96,50.32 38.61,50.67 36.96,50.67 36.58,50.29 36.58,49.4 34.92,47.75 34.92,44.45 34.6,44.13 R21.2 32.95,44.13 32.26,43.43 v32.26,37.59 | v30.48,20.83 32.92,20.83 U6.1
  Bottom 0.254: v30.48,20.83 30.48,33.78 32.26,35.56 v32.26,37.59
!Z-ENABLE  (via drill 0.3)
  Top 0.254: U4.23 59.28,50.32 58.93,50.67 57.53,50.67 56.9,50.04 56.9,49.28 55.24,47.62 55.24,44.45 54.99,44.2 54.04,44.2 | 54.04,44.2 53.09,44.2 52.32,43.43 52.32,38.86 50.8,37.34 49.78,37.34 47.75,35.31 v46.99,35.31 | 54.04,44.2 R27.2 | U6.42 50.29,31.41 v50.29,31.5
  Bottom 0.254: v46.99,35.31 50.29,32 v50.29,31.5
+3V3  (via drill 0.3)
  Top 0.254: U8.1 75.8,8.28 v75.95,8.13 75.95,6.35 78.23,4.06 80.01,4.06 80.26,3.81 83.57,3.81 84.5,4.74 SD.P$4 | U8.8 v73.41,12.83
  Top 0.508: v73.41,12.83 73.66,13.08 C32.1 74.54,15.61 74.93,16 74.93,20.08 U7.2
  pour PWR (isolate 0.254): 100.08,16.76 72.64,16.76 72.64,7.62 78.23,7.62 78.23,0 100.08,0
+5V  (via drill 0.3)
  Top 0.254: R4.1 25.34,38.67 25.53,38.86 25.53,40.39 25.65,40.51 26.66,40.51 C15.2 | R22.1 45.66,38.67 45.85,38.86 45.85,40.39 45.98,40.52 C20.2 | C25.2 67.17,40.39 66.29,40.39 66.17,40.26 66.17,38.73 66.11,38.67 R28.1 | R34.1 86.43,38.67 86.61,38.86 86.61,40.39 86.75,40.52 C30.2 | R13.2 57.12,33.02 v57.91,33.02 | 49.33,12.14 49.33,11.99 49.28,11.94 | U10.4 28.57,31.89 28.45,32 28.45,32.51 | 28.45,32.51 28.45,33.27 28.56,33.38 U10.1 29.68,34.5 30.23,35.05 R5.2 | 28.45,32.51 C42.2 27.3,32.5 27.3,31.5 27.18,31.37 25.65,31.37 25.47,31.18 R15.2 | 70.2,8.74 U8.14 68.04,8.92 67.56,9.4 66.36,9.4 R12.2 | R1.2 74.17,27.11 74.17,28.19 74.42,28.45 74.93,28.45 EXP2.2
  Top 0.305: USBPWR.2 24.95,20.52 v24.89,20.57
  Top 0.406: 49.28,11.94 49.22,11.94 C36.2
  Top 0.457: U2.10 23.84,41.95 24.13,41.66 26.42,41.66 26.67,41.4 C15.2 27.55,40.52 28.45,39.62 v28.45,38.86 | 14.48,36.07 11.68,38.86 11.68,43.94 | U3.10 44.16,42.2 44.7,41.66 46.48,41.66 46.99,41.15 C20.2 48.01,40.52 v49.02,39.51 | MS-Y.2 v34.04,38.86 | U4.10 64.48,42.2 65.02,41.66 66.8,41.66 67.31,41.15 C25.2 68.19,40.52 v69.09,39.62 | MS-Z.2 v54.1,38.86 | U5.10 84.8,42.2 85.34,41.66 87.63,41.66 87.76,41.53 C30.2 89.02,40.52 v89.28,40.26 | MS-E.2 v74.42,38.61 | U6.21 48.51,15.09 v48.51,12.95 49.33,12.14
  Top 0.508: 11.68,43.94 12.26,44.52 R3.1 MS-X.2 | 14.48,36.07 v15.73,36.07 | MS-Y.2 34.04,41.98 R21.1 | MS-Z.2 R27.1 | MS-E.2 R33.1 | R10.2 69.28,18.99 69.6,19.3 69.6,20.25 R9.2 69.6,20.39 v69.6,21.84 | v81.79,18.54 80.01,18.54 79.5,19.05 79.5,20.07 78.66,20.91 U7.1 | U6.64 33.03,23.48 C34.2 v31.5,22.1 | U6.52 39.51,33.15 C13.2 | v37.72,34.35 37.86,34.35 C13.2 | C13.2 38.99,33.15 | 70.2,8.74 69.45,8.74 v68.58,7.87
  Top 0.61: v27.43,34.04 27.43,32.63 C42.2
  Top 0.813: v81.79,18.54 R37.1
  Top 1.27: C1.1 82.8,24.89 83.31,25.4 83.31,28.91 L1.P$2
  other vias: 79.76,26.42 80.52,26.42 79.76,23.37 80.52,23.37
  pour PWR (isolate 0.254): 100.08,41.91 14.99,41.91 14.99,5.33 17.78,5.33 17.78,0 77.6,0 77.6,6.99 72.01,6.99 72.01,17.4 100.08,17.4
  pour Top (isolate 0.254): 81.03,22.99 81.03,26.8 79.25,26.8 79.25,22.99
A2  (via drill 0.3)
  Top 0.254: U6.59 41.88,22.86 49.28,22.86 50.04,22.1 v50.8,22.1 | EXP1.2 49.28,6.35 50.04,7.11 53.09,7.11 58.17,12.19 58.17,12.7 v58.67,13.21
  Bottom 0.254: v58.67,13.21 58.67,14.99 51.56,22.1 v50.8,22.1
A3  (via drill 0.3)
  Top 0.254: U6.58 42.5,23.37 49.78,23.37 v50.04,23.11 | EXP1.4 59.18,12.19 v59.18,12.32
  Bottom 0.254: v59.18,12.32 59.44,12.57 59.44,14.99 51.31,23.11 v50.04,23.11
ALE
  Top 0.254: U6.43 50.82,33.08 BOOT.2 52.14,33.09 53.09,34.04 54.61,34.04 55.12,33.53 55.05,33.53 R13.1
AREF
  Top 0.508: C3.1 29.58,27.18 34.16,27.18 U6.62
B-THERM  (via drill 0.3)
  Top 0.254: v71.12,14.48 71.12,18.23 R10.1 71.18,20.27 C9.2 | U6.61 40.63,21.84 48.51,21.84 49.02,21.34 49.02,20.83 49.53,20.32 v49.78,20.32
  Bottom 0.254: v49.78,20.32 51.82,20.32 57.4,14.73 57.4,10.92 58.17,10.16 64.77,10.16 68.83,14.22 70.87,14.22 v71.12,14.48 71.37,14.22 94.74,14.22 95.76,15.24 95.76,22.86 T-BED.1
E-DIR  (via drill 0.3)
  Top 0.254: U5.14 85.45,50.4 85.85,50.8 86.87,50.8 89.41,53.34 v91.69,53.34 | U6.44 51.67,35.05 86.11,35.05 v86.36,34.8
  Bottom 0.254: v86.36,34.8 87.12,34.8 87.38,34.54 88.65,34.54 94.23,40.13 94.23,49.78 91.69,52.32 v91.69,53.34
E-STEP
  Top 0.254: U5.11 85.45,42.31 85.6,42.16 88.65,42.16 90.04,40.77 90.04,38.99 86.61,35.56 51.04,35.56 U6.45
E-THERM  (via drill 0.3)
  Top 0.254: v67.56,15.24 67.56,18.28 C10.2 67.58,20.27 R9.1 | U6.60 41.25,22.35 48.77,22.35 v49.78,21.34
  Bottom 0.254: v67.56,15.24 67.94,14.86 67.94,14.73 | 67.94,14.73 67.94,14.35 64.26,10.67 58.42,10.67 57.91,11.18 57.91,14.99 51.56,21.34 v49.78,21.34 | 67.94,14.73 70.36,14.73 70.87,15.24 71.37,15.24 71.88,14.73 94.49,14.73 95.25,15.49 95.25,26.16 T-EXT.1
GND  (via drill 0.3, 3.68 pad 5.71)
  other vias: 36.2,18.54 25.53,34.16 22.86,19.43 28.57,23.62 96.27,3.81 3.81,3.81 3.81,57.15 96.27,57.15 17.27,55.12 25.91,55.12 20.07,47.24 21.59,47.24 23.11,47.24 20.07,45.72 21.59,45.72 23.11,45.72 37.59,55.12 46.23,55.12 78.23,55.12 79.25,55.12 85.85,55.12 86.87,55.12 57.91,55.12 58.93,55.12 65.53,55.12 66.55,55.12 38.61,55.12 45.21,55.12 18.29,55.12 24.89,55.12 40.39,47.24 41.91,47.24 43.43,47.24 43.43,45.72 41.91,45.72 40.39,45.72 58.17,47.24 58.17,46.48 59.18,48.01 59.18,47.24 65.28,47.24 59.18,46.48 79.5,48.01 85.6,47.24 85.6,48.01 79.5,47.24 79.5,46.48 85.6,46.48 16,42.93 9.4,56.39 9.4,57.66 12.45,56.39 29.97,55.37 29.97,57.91 29.97,56.64 76.83,39.37 82.8,37.47 36.32,43.18 56.39,39.62 68.83,38.35 44.7,36.07 24.38,37.34 56.13,11.81 47.12,17.65 41.53,30.1 35.81,24.38 12.45,57.66 33.27,57.91 33.27,56.64 33.27,55.37 50.67,55.24 70.74,57.78 9.4,55.12 12.45,55.12 50.67,57.78 50.67,56.52 53.98,57.78 53.98,56.52 53.98,55.24 70.74,56.52 70.74,55.24 74.04,57.78 74.04,56.52 74.04,55.24 82.55,55.88 78.49,47.24 78.49,48.01 86.61,48.01 86.61,47.24 62.23,55.88 41.91,55.88 65.28,46.48 65.28,45.72 66.29,46.48 66.29,47.24 66.29,45.72 86.61,46.48 58.17,48.01 65.28,44.96 66.29,44.96 65.28,48.01 66.29,48.01 58.17,45.72 59.18,45.72 21.59,55.88 60.45,47.24 62.23,47.24 64.01,47.24 64.01,45.72 62.23,45.72 60.45,45.72 80.77,47.24 80.77,45.72 82.55,45.72 84.33,45.72 84.33,47.24 82.55,47.24 78.49,46.48 78.49,45.72 79.5,45.72 85.6,45.72 85.6,44.96 86.61,45.72 86.61,44.96 37.85,47.24 37.85,46.48 38.86,48.01 38.86,47.24 38.86,46.48 37.85,48.01 37.85,45.72 38.86,45.72 44.96,48.01 44.96,47.24 44.96,46.48 44.96,45.72 44.96,44.96 45.97,44.96 45.97,45.72 45.97,46.48 45.97,47.24 45.97,48.01 18.54,48.01 17.53,48.01 17.53,47.24 17.53,46.48 17.53,45.72 18.54,45.72 18.54,46.48 18.54,47.24 24.64,48.01 25.65,48.01 25.65,47.24 25.65,46.48 25.65,45.72 25.65,44.96 24.64,44.96 24.64,45.72 24.64,46.48 24.64,47.24 49.15,15.75 81.79,6.86 74.17,11.68 87.76,20.83 87.76,22.23 80.26,21.59 83.82,21.59 86.11,17.53 92.71,18.29 88.39,16 33.66,26.16 51.82,9.53 78.23,26.67 78.23,23.11 51.05,41.15 41.27,38.48 38.73,30.86 44.07,31.88 34.54,34.54 36.83,30.99 51.44,16.26 18.67,33.02 18.67,30.1 20.95,31.5 73.41,18.8 91.69,40.89 92.46,40.89 90.17,43.69 90.93,43.69 96.77,19.3 81.28,7.37
  pour Top (isolate 0.203, rank 6): 0,60.96 100.08,60.96 100.08,0 0,0
  pour Bottom (rank 6): 0,60.96 100.08,60.96 100.08,0 0,0
  pour GND (isolate 0.254): 0,60.96 100.08,60.96 100.08,0 0,0
  pour GND (isolate 0.254, no thermals): 4.32,48.26 1.02,48.26 1.02,36.58 4.32,36.58
  pour Top (isolate 0.254, no thermals): 4.06,48.01 1.02,48.01 1.02,36.83 4.06,36.83
  pour Bottom (no thermals): 2.54,48.26 4.06,48.26 4.06,36.58 1.02,36.58 1.02,48.26
HOTBED-GND
  pour Top (isolate 0.254, no thermals): 8.13,16.64 12.95,16.64 13.21,16.38 13.21,15.11 12.95,14.86 9.91,14.86 6.73,10.92 2.29,10.92 2.29,15.37 6.86,15.37
  pour Bottom (isolate 0.254, no thermals): 2.29,15.37 6.86,15.37 8.13,16.64 12.95,16.64 13.21,16.38 13.21,15.11 12.95,14.86 9.91,14.86 6.73,10.92 2.29,10.92
HOTEND-GND
  pour Top (isolate 0.254, no thermals): 5.59,28.45 9.4,28.45 9.65,28.19 9.65,27.18 9.4,26.92 6.35,26.92 4.06,25.4 4.06,22.86 2.03,22.86 2.03,27.43 4.06,27.43
MCU_DN
  Top 0.254: R7.1 30.7,15.2 29.34,13.84 | 29.34,13.84 27.69,12.19 20.32,12.19 15.49,7.37 14.22,7.37 12.56,5.7 USB-M.D- | U9.3 28.48,14.7 29.34,13.84
MCU_DP  (via drill 0.3)
  Top 0.254: R8.1 31.2,14.7 27.94,11.43 v26.16,11.43 20.57,11.43 15.75,6.6 14.22,6.6 13.21,5.59 USB-M.D+ | U9.1 26.64,13.43 v26.16,12.95
  Bottom 0.254: v26.16,12.95 v26.16,11.43
MISO  (via drill 0.3)
  Top 0.254: U8.13 71.2,9.57 v72.14,8.64 | v45.97,16.51 44.96,15.49 42.67,15.49 42.16,16 41.67,16 U6.13
  Bottom 0.254: v45.97,16.51 53.85,8.64 v72.14,8.64 72.64,8.64 74.68,6.6 ICSP.6
MOSI  (via drill 0.3)
  Top 0.254: U6.12 41.04,16.51 43.18,16.51 v43.43,16.26 | U8.11 72.19,10.87 73.91,9.14 73.91,5.84 73.41,5.33 73.41,3.56 ICSP.3
  Bottom 0.254: v43.43,16.26 43.43,16 52.83,6.6 69.6,6.6 70.87,5.33 70.87,3.56 ICSP.3
N$1
  Top 0.254: R1.1 76.35,25.09 LED1.A
N$2
  Top 0.61: FAN1.2 96.39,51.44 Q3.3 92.65,47.78 D2.C
N$3
  Top 0.254: U6.4 32.92,17.44 R7.2
N$4
  Top 0.254: U6.5 33.44,16.82 R8.2
N$6
  Top 0.254: Z-STOP.1 41.66,4.32 41.66,7.87 42.86,9.08 Q4.1
N$7
  Top 0.254: R11.2 24.96,25.21 18.03,18.29 Q2.1
N$8
  Top 0.61: D3.C 95,41.4 93.1,43.3 Q5.3 95.38,45.97 FAN2.2
N$9
  Top 0.508: U6.7 36.58,17.7 36.58,16.26 36.58,15.75 C11.2
N$10
  Top 0.406: X-MOT.3 22.86,51.97 21.89,51 U2.18
N$11
  Top 0.254: U2.1 16.63,42.02 C5.2
N$12
  Top 0.254: U2.2 18.64,41.36 C5.1
N$13
  Top 0.254: U2.8 22.54,40.76 R2.1
N$14
  Top 0.406: U2.17 22.54,50.84 23.94,52.24 R17.1
N$15
  Top 0.406: R18.1 19.24,52.24 20.59,50.89 U2.20
N$16
  Top 0.406: U2.3 19.29,44.46 19.05,44.7 15.89,44.7 C4.2
N$17
  Top 0.406: U2.15 23.84,50.51 24.51,51.18 25.53,51.18 26.92,52.58 26.92,56.13 X-MOT.4
N$19
  Top 0.254: C8.2 19.94,40.63 U2.4
N$20
  Top 0.406: X-MOT.2 20.32,51.97 21.24,51.05 U2.19
N$21
  Top 0.254: U2.7 21.89,44.37 22.1,44.58 22.86,44.58 23.11,44.32 23.11,43.46 U2.9 23.19,41.77 R4.2
N$22
  Top 0.508: U1.3 89.02,20.44 88.58,20.44 R38.1
  Top 0.813: R37.2 85.85,18.54 86.8,19.49 R38.1
N$23
  Top 0.406: U2.22 19.29,50.43 18.54,51.18 17.65,51.18 16.26,52.58 16.26,56.13 X-MOT.1
N$24
  Top 0.406: Y-MOT.2 40.64,52.02 41.56,51.1 U3.19
N$25
  Top 0.406: U3.22 39.61,50.43 38.86,51.18 37.85,51.18 36.58,52.45 36.58,56.13 Y-MOT.1
N$26
  Top 0.406: U3.15 44.16,50.51 44.83,51.18 46.1,51.18 47.24,52.32 47.24,56.13 Y-MOT.4
N$27
  Top 0.254: U2.5 20.59,39.39 18.54,37.34 14.99,37.34 14.61,37.72 MS-X.1
N$28
  Top 0.254: U2.6 21.24,39.27 18.8,36.83 14.73,36.83 12.95,38.61 12.9,38.66 12.83,38.73 MS-X.3
N$29
  Top 0.254: U3.1 37.08,42.16 37.08,41.29 C17.2
N$30
  Top 0.254: U3.2 38.96,41.36 C17.1
N$31
  Top 0.406: Y-MOT.3 43.18,52.02 42.21,51.05 U3.18
N$32
  Top 0.406: U3.20 40.91,50.91 39.56,52.26 R19.1
N$34
  Top 0.254: U3.8 42.86,40.64 42.79,40.57 R20.1
N$35
  Top 0.254: U3.4 40.26,40.01 39.37,39.12 C19.2
N$36
  Top 0.254: U3.7 42.21,44.37 42.42,44.58 43.31,44.58 43.51,44.37 U3.9 43.51,42.02 44.7,40.83 R22.2
N$37
  Top 0.254: 36.06,44.7 36.07,44.7 C21.2
  Top 0.406: U3.3 39.61,44.46 39.37,44.7 36.06,44.7
N$38
  Top 0.406: U3.17 42.86,50.86 44.26,52.26 R16.1
N$39
  Top 0.406: U4.15 64.48,50.51 65.15,51.18 66.17,51.18 67.56,52.58 67.56,56.13 Z-MOT.4
N$40
  Top 0.406: Z-MOT.3 63.5,52.02 62.53,51.05 U4.18
N$41
  Top 0.406: Z-MOT.2 60.96,52.02 61.88,51.1 U4.19
N$42
  Top 0.254: U3.5 40.91,39.89 39.88,38.86 39.88,38.1 39.62,37.85 35.56,37.85 34.92,38.48 MS-Y.1
N$43
  Top 0.254: U3.6 41.56,39.78 40.39,38.61 40.39,37.85 39.88,37.34 33.78,37.34 33.15,37.97 MS-Y.3
N$44
  Top 0.254: U4.1 57.77,43.38 C22.2
N$45
  Top 0.254: U4.2 59.28,41.4 C22.1
N$46
  Top 0.406: U4.17 63.18,50.86 64.58,52.26 R24.1
N$47
  Top 0.406: U4.20 61.23,50.91 59.88,52.26 R25.1
N$49
  Top 0.254: U4.8 63.18,40.57 R26.1
N$50
  Top 0.254: U4.4 60.58,39.5 60.45,39.37 C24.2
N$51
  Top 0.254: U4.7 62.53,44.37 62.74,44.58 63.63,44.58 63.83,44.37 U4.9 63.83,41.77 R28.2
N$52
  Top 0.457: U4.3 59.93,44.46 59.69,44.7 57.01,44.7
  Top 0.508: 57.01,44.7 56.5,44.7 C26.2
N$53
  Top 0.406: U4.22 59.93,50.43 59.18,51.18 58.17,51.18 56.9,52.45 56.9,56.13 Z-MOT.1
N$54
  Top 0.406: U5.15 84.8,50.43 85.72,51.36 86.67,51.36 87.88,52.58 87.88,56.13 E-MOT.4
N$55
  Top 0.406: U5.18 82.85,51.02 83.82,51.99 E-MOT.3
N$56
  Top 0.406: U5.19 82.2,51.02 81.28,51.94 E-MOT.2
N$57
  Top 0.254: U4.5 61.23,38.88 60.45,38.1 55.37,38.1 54.99,38.48 MS-Z.1
N$58
  Top 0.254: U4.6 61.88,38.51 60.83,37.47 54.1,37.47 53.21,38.35 MS-Z.3
N$59
  Top 0.254: U5.1 78.09,42.53 C27.2
N$60
  Top 0.254: U5.2 79.6,41.4 C27.1
N$61
  Top 0.406: U5.17 83.5,50.86 84.9,52.26 R30.1
N$62
  Top 0.406: U5.20 81.55,50.86 80.26,52.15 80.26,53.53
  Top 0.457: 80.26,53.53 R31.1
N$64
  Top 0.254: U5.8 83.5,40.64 R32.1
N$65
  Top 0.254: U5.4 80.9,39.5 80.77,39.37 C29.2
N$66
  Top 0.254: U5.7 82.85,44.37 83.06,44.58 83.95,44.58 84.15,44.37 U5.9 84.15,42.02 R34.2
N$67
  Top 0.356: U5.3 80.25,44.46 80.01,44.7 77.59,44.7 C31.2
N$68
  Top 0.356: U5.22 80.26,49.5
  Top 0.406: 80.26,49.5 80.26,50.42 79.38,51.31 78.49,51.31 77.22,52.58 77.22,56.13 E-MOT.1
N$71
  Top 0.254: Q1.1 8.38,30.23 12.51,26.1 R36.2
N$72
  Top 0.254: U5.5 81.55,38.62 80.77,37.85 76.2,37.85 75.31,38.73 MS-E.1
N$73
  Top 0.254: U5.6 82.2,38.26 81.28,37.34 74.42,37.34 73.53,38.23 MS-E.3
N$75
  Top 0.254: U1.6 90.79,22.59 90.55,22.35 90.55,20.19 91.32,19.42 C2.1
  Top 0.61: 89.66,25.65 L1.P$1 | 89.66,25.65 91.69,23.62 91.69,22.66 U1.6 | D1.C 86.07,22.07 89.66,25.65
N$77
  Top 0.254: U1.1 89.81,22.59 90.04,22.35 90.04,20.19 89.52,19.67 C2.2
PB5  (via drill 0.3)
  Top 0.254: U6.15 41.66,13.73 41.66,13.21 v43.69,11.18
  Bottom 0.254: EXP1.1 46.74,2.29 44.7,4.32 44.7,10.16 v43.69,11.18
PB6  (via drill 0.3)
  Top 0.254: 45.72,10.81 v45.72,10.67 42.8,13.59 U6.16
  Bottom 0.254: EXP1.11 60.71,3.56 46.99,3.56 45.72,4.83 v45.72,10.67
PC0
  Top 0.254: EXP2.12 64.01,29.21 62.23,27.43 54.23,27.43 U6.35
PC1
  Top 0.254: EXP2.13 61.72,32.77 62.74,31.75 62.74,29.21 61.47,27.94 53.6,27.94 U6.36
PC2
  Top 0.254: U6.37 52.98,28.45 59.69,28.45 EXP2.14
PD2-RX1
  Top 0.254: 52.1,18.29 57.66,18.29 60.96,14.99 60.96,10.67 55.63,5.33 55.63,3.56 EXP1.5 | U6.27 52.1,18.29 | 52.1,18.29
PD3-TX1
  Top 0.254: 52.73,18.8 57.91,18.8 62.99,13.72 62.99,10.16 58.17,5.33 58.17,3.56 EXP1.7 | U6.28 52.73,18.8 | 52.73,18.8
PD4
  Top 0.254: 52.84,19.81 55.37,19.81 58.8,23.24 68.45,23.24 72.9,27.69 72.9,31.75 71.88,32.77 EXP2.5 | U6.29 52.84,19.81 | 52.84,19.81
PD5
  Top 0.254: 53.47,20.32 54.61,20.32 58.17,23.88 67.56,23.88 71.63,27.94 EXP2.6 | U6.30 53.47,20.32 | 53.47,20.32
PD6
  Top 0.254: 53.84,21.08 54.36,21.08 57.78,24.51 66.93,24.51 70.36,27.94 70.36,31.75 69.34,32.77 EXP2.7 | U6.31 53.84,21.08 | 53.84,21.08
PD7
  Top 0.254: 56.75,25.15 65.53,25.15 69.09,28.7 EXP2.8 | U6.32 56.75,25.15 | 56.75,25.15
PE0
  Top 0.254: EXP2.10 66.55,28.96 63.94,26.35 55.41,26.35 U6.33
PE1
  Top 0.254: 54.85,26.92 62.99,26.92 65.28,29.21 65.28,31.75 64.26,32.77 EXP2.11 | U6.34 54.85,26.92 | 54.85,26.92
PE5  (via drill 0.3)
  Top 0.254: U6.19 47.24,14.1 47.24,2.54 46.99,2.29 v46.99,1.52
  Bottom 0.254: EXP1.3 50.29,0.76 47.75,0.76 v46.99,1.52
SCL  (via drill 0.3)
  Top 0.254: U6.25 49.08,19.05 48.01,19.05 v47.24,19.81 | U10.2 31.63,32.88 | 31.63,32.88 32.26,32.26 32.26,30.48 v32.51,30.23 | 31.63,32.88 31.63,32.9 33.02,34.29 33.02,34.86 R5.1
  Bottom 0.254: v32.51,30.23 35.56,27.18 39.88,27.18 v47.24,19.81 47.24,19.56
SCLK  (via drill 0.3)
  Top 0.254: U8.12 72.07,10.22 73.41,8.89 73.41,6.1 ICSP.4 | U6.11 40.42,17.02 43.69,17.02 v44.45,16.26
  Bottom 0.254: v44.45,16.26 44.45,15.75 53.09,7.11 69.85,7.11 ICSP.4
SDA  (via drill 0.3)
  Top 0.254: U6.26 49.7,19.56 49.28,19.56 48.77,20.07 v48.51,20.07 | U10.3 31.37,32.38 31.75,32 31.75,29.72 | 31.75,29.72 32,29.46 v34.29,29.46 | R15.1 31.24,30.23 31.75,29.72
  Bottom 0.254: v48.51,20.07 40.64,27.94 35.81,27.94 v34.29,29.46
SDCD  (via drill 0.3)
  Top 0.254: 45.97,12.19 v45.72,12.19 45.97,12.45 45.97,13.11 U6.17 | v48.77,9.14 49.53,8.38 52.32,8.38 54.1,10.16 v55.12,10.16 | SD.CD 82.48,16.07 83.06,15.49 v83.06,13.46
  Bottom 0.254: v45.72,12.19 46.48,12.19 48.77,9.91 v48.77,9.14 | v55.12,10.16 55.63,9.65 65.28,9.65 68.71,13.08 69.34,13.72 82.8,13.72 v83.06,13.46
SDCLK
  Top 0.254: U8.3 77.41,10.22 77.72,9.91 80.52,9.91 83.4,7.03 SD.P$5
SDCS  (via drill 0.3)
  Top 0.254: v48.77,7.62 52.58,7.62 v54.36,9.4 | U8.10 68.42,11.52 v68.33,11.43 | v40.89,11.94 38.35,14.48 38.35,16.08 U6.10
  Bottom 0.254: v68.33,11.43 66.04,9.14 54.61,9.14 v54.36,9.4 | v40.89,11.94 44.7,11.94 45.21,11.43 46.23,11.43 48.01,9.65 48.01,8.38 v48.77,7.62
SDCSH
  Top 0.254: U8.5 77.31,11.52 77.47,11.68 85.09,11.68 86.7,10.08 SD.P$2
SDDI
  Top 0.254: U8.4 84.79,10.87 85.6,10.06 SD.P$3
SDDO
  Top 0.254: U8.2 76.92,9.57 77.09,9.4 77.09,7.49 77.47,7.11 80.26,7.11 81.2,6.18 SD.P$7
TCK  (via drill 0.3)
  Top 0.254: U6.57 43.12,23.88 v50.8,23.88 | EXP1.6 60.2,10.67 v60.2,12.19
  Bottom 0.254: v60.2,12.19 60.2,14.99 51.31,23.88 v50.8,23.88
TDI  (via drill 0.3)
  Top 0.254: v49.78,25.65 45.47,25.65 44.7,26.42 43.98,26.42 U6.54 | EXP1.12 64.52,7.37 v64.52,13.46
  Bottom 0.254: v49.78,25.65 51.05,25.65 63.25,13.46 v64.52,13.46
TMS  (via drill 0.3)
  Top 0.254: v48.01,24.64 47.75,24.38 43.75,24.38 | 43.75,24.38 | U6.56 43.75,24.38 | EXP1.8 61.72,9.65 v61.72,13.72
  Bottom 0.254: v61.72,13.72 60.71,14.73 60.71,15.24 51.31,24.64 v48.01,24.64
VBUS
  Top 0.254: U6.8 38.86,18.85 38.86,19.3 36.45,21.72 36.07,21.72 U6.3 33.15,18.8 27.73,18.8 C14.1 27.56,18.93 27.56,18.92 | 20.07,16.76 11.91,8.61 USB-M.VBUS | 25.02,16.89 25.93,15.98 25.93,15.72 U9.5
  Top 0.305: 20.07,16.76 24.89,16.76 25.02,16.89 25.85,17.72 USBPWR.1 25.91,19.05
  Top 0.406: C14.1 27.48,19.05 25.91,19.05
VREF_E  (via drill 0.3)
  Top 0.254: U5.12 88.19,43.38 90.7,40.87 C41.1 89.56,36.83 v88.9,36.83 | U10.6 35.67,31.39 v35.81,31.24
  Bottom 0.254: v88.9,36.83 88.39,36.32 74.17,36.32 73.15,37.34 72.39,37.34 71.88,36.83 41.4,36.83 v35.81,31.24
VREF_X  (via drill 0.3)
  Top 0.254: U2.12 26.72,43.38 27.18,42.93 C39.1 28.31,41.79 28.7,41.4 v29.21,41.4 | U10.9 34.92,32.88 35.31,33.27 v35.31,35.31
  Bottom 0.254: v29.21,41.4 29.21,39.62 30.48,38.35 32.77,38.35 35.31,35.81 v35.31,35.31
VREF_Y  (via drill 0.3)
  Top 0.254: U3.12 47.3,43.38 48.01,42.67 C38.1 48.88,41.54 49.28,41.15 49.78,41.15 50.55,40.39 v50.55,38.86 | U10.8 35.18,32.38 36.07,33.27 v36.07,33.53
  Bottom 0.254: v50.55,38.86 50.55,38.61 49.78,37.85 39.37,37.85 36.07,34.54 v36.07,33.53
VREF_Z  (via drill 0.3)
  Top 0.254: v70.87,37.85 70.87,39.88 70.61,40.13 C40.1 68.46,42.03 67.11,43.38 U4.12 | U10.7 35.7,31.89 37.08,33.27 v37.08,33.53
  Bottom 0.254: v70.87,37.85 70.36,37.34 39.62,37.34 36.83,34.54 36.83,33.78 v37.08,33.53
X-DIR
  Top 0.254: U2.14 24.49,50.4 24.77,50.67 28.83,50.67 29.21,50.29 29.21,49.53 29.46,49.28 30.48,49.28 31.24,48.51 31.24,40.89 30.73,40.39 30.73,37.59 31.5,36.83 38.09,36.83 U6.50
X-STEP
  Top 0.254: U2.11 24.49,42.31 24.64,42.16 26.92,42.16 30.23,38.86 30.23,37.34 31.24,36.32 37.47,36.32 U6.51
X-STOP
  Top 0.254: U6.9 37.59,16.45 37.59,13.72 28.96,5.08 27.69,5.08 25.91,3.3 X-STOP.1
XTAL1
  Top 0.254: U6.24 49.98,17.02 50.29,17.02 50.8,17.53 53.59,17.53 54.1,17.02 C44.2 55.77,15.48 X1.P$1
XTAL2
  Top 0.254: U6.23 50.04,15.83 50.04,13.97 50.55,13.46 50.55,13.21 | 50.55,13.21 50.8,13.21 51.31,12.7 52.32,12.7 52.83,12.19 52.83,11.94 X1.P$2 | C43.2 50.55,13.21
Y-DIR
  Top 0.254: U3.14 44.81,50.4 45.09,50.67 49.4,50.67 49.78,50.29 49.78,49.53 50.04,49.28 51.31,49.28 51.82,48.77 51.82,39.12 50.55,37.85 49.53,37.85 48.26,36.58 46.99,36.58 45.97,35.56 45.97,33.88 U6.48
Y-STEP
  Top 0.254: U3.11 44.81,42.31 44.96,42.16 47.24,42.16 48.77,40.64 49.53,40.64 49.78,40.39 49.78,38.86 48.01,37.08 46.74,37.08 42.91,33.25 | 42.91,33.25 | 42.91,33.25 U6.49
Y-STOP
  Top 0.254: U6.14 40.89,14.1 40.89,13.21 42.16,11.94 42.16,9.14 38.35,5.33 34.54,5.33 34.04,4.83 Y-STOP.1
Z-DIR
  Top 0.254: U4.14 65.13,50.4 65.41,50.67 69.6,50.67 69.85,50.42 69.85,49.53 70.1,49.28 71.37,49.28 71.88,48.77 71.88,36.96 71.12,36.2 50.55,36.2 U6.46
Z-STEP
  Top 0.254: U4.11 65.13,42.31 65.28,42.16 67.56,42.16 70.1,39.62 70.1,37.21 69.72,36.83 50.05,36.83 U6.47
Z-STOP
  Top 0.254: U6.18 46.74,13.47 46.74,8.38 46.48,8.13 Q4.3

### Text on the board
tPlace: Printrboard | Rev. F6 | printrbot.com | Laine Walker-Avina (C) 2016 | CC-BY-SA
tNames: RST
_tsilk: C6 | C16 | C18 | C23 | R24 | X-MOT | Y-MOT | R16 | Z-MOT | E-MOT | R30 | Q3 | R18 | R17 | R19 | R25 | R31 | C28 | C33 | C35 | C37 | PWR | U2 | U3 | U4 | U5 | D2 | C21 | C26 | C31 | C4 | FAN1 | R3 | C39 | C38 | Q5 | C17 | C5 | R21 | R27 | C22 | C40 | R33 | C27 | C41 | FAN2 | D3 | MS-X | MS-Y | MS-Z | MS-E | C8 | R2 | R4 | C15 | C19 | R20 | R22 | C20 | C24 | R26 | R28 | C25 | C29 | R32 | R34 | C30 | R5 | R13 | C42 | R23 | R14 | HOTEND | Q1 | T-EXT | C7 | C13 | L1 | U10 | BOOT | R15 | C3 | EXP2 | LED1 | R36 | U6 | R11 | R35 | C34 | R1 | C1 | U1 | R6 | D1 | C12 | R9 | C9 | C44 | R37 | C10 | T-BED | C14 | R7 | U7 | C2 | USBPWR | C43 | R10 | R38 | RST | R8 | C11 | C32 | X1 | Printrboard | Rev. F6 | printrbot.com | Laine Walker-Avina (C) 2016 | CC-BY-SA | U9 | HOTBED | Q4 | R12 | Q2 | C36 | U8 | X-STOP | Y-STOP | Z-STOP | EXP1 | ICSP | SD